# EAGLE design 4 port powered backplane (EAGLE 9.5.1)
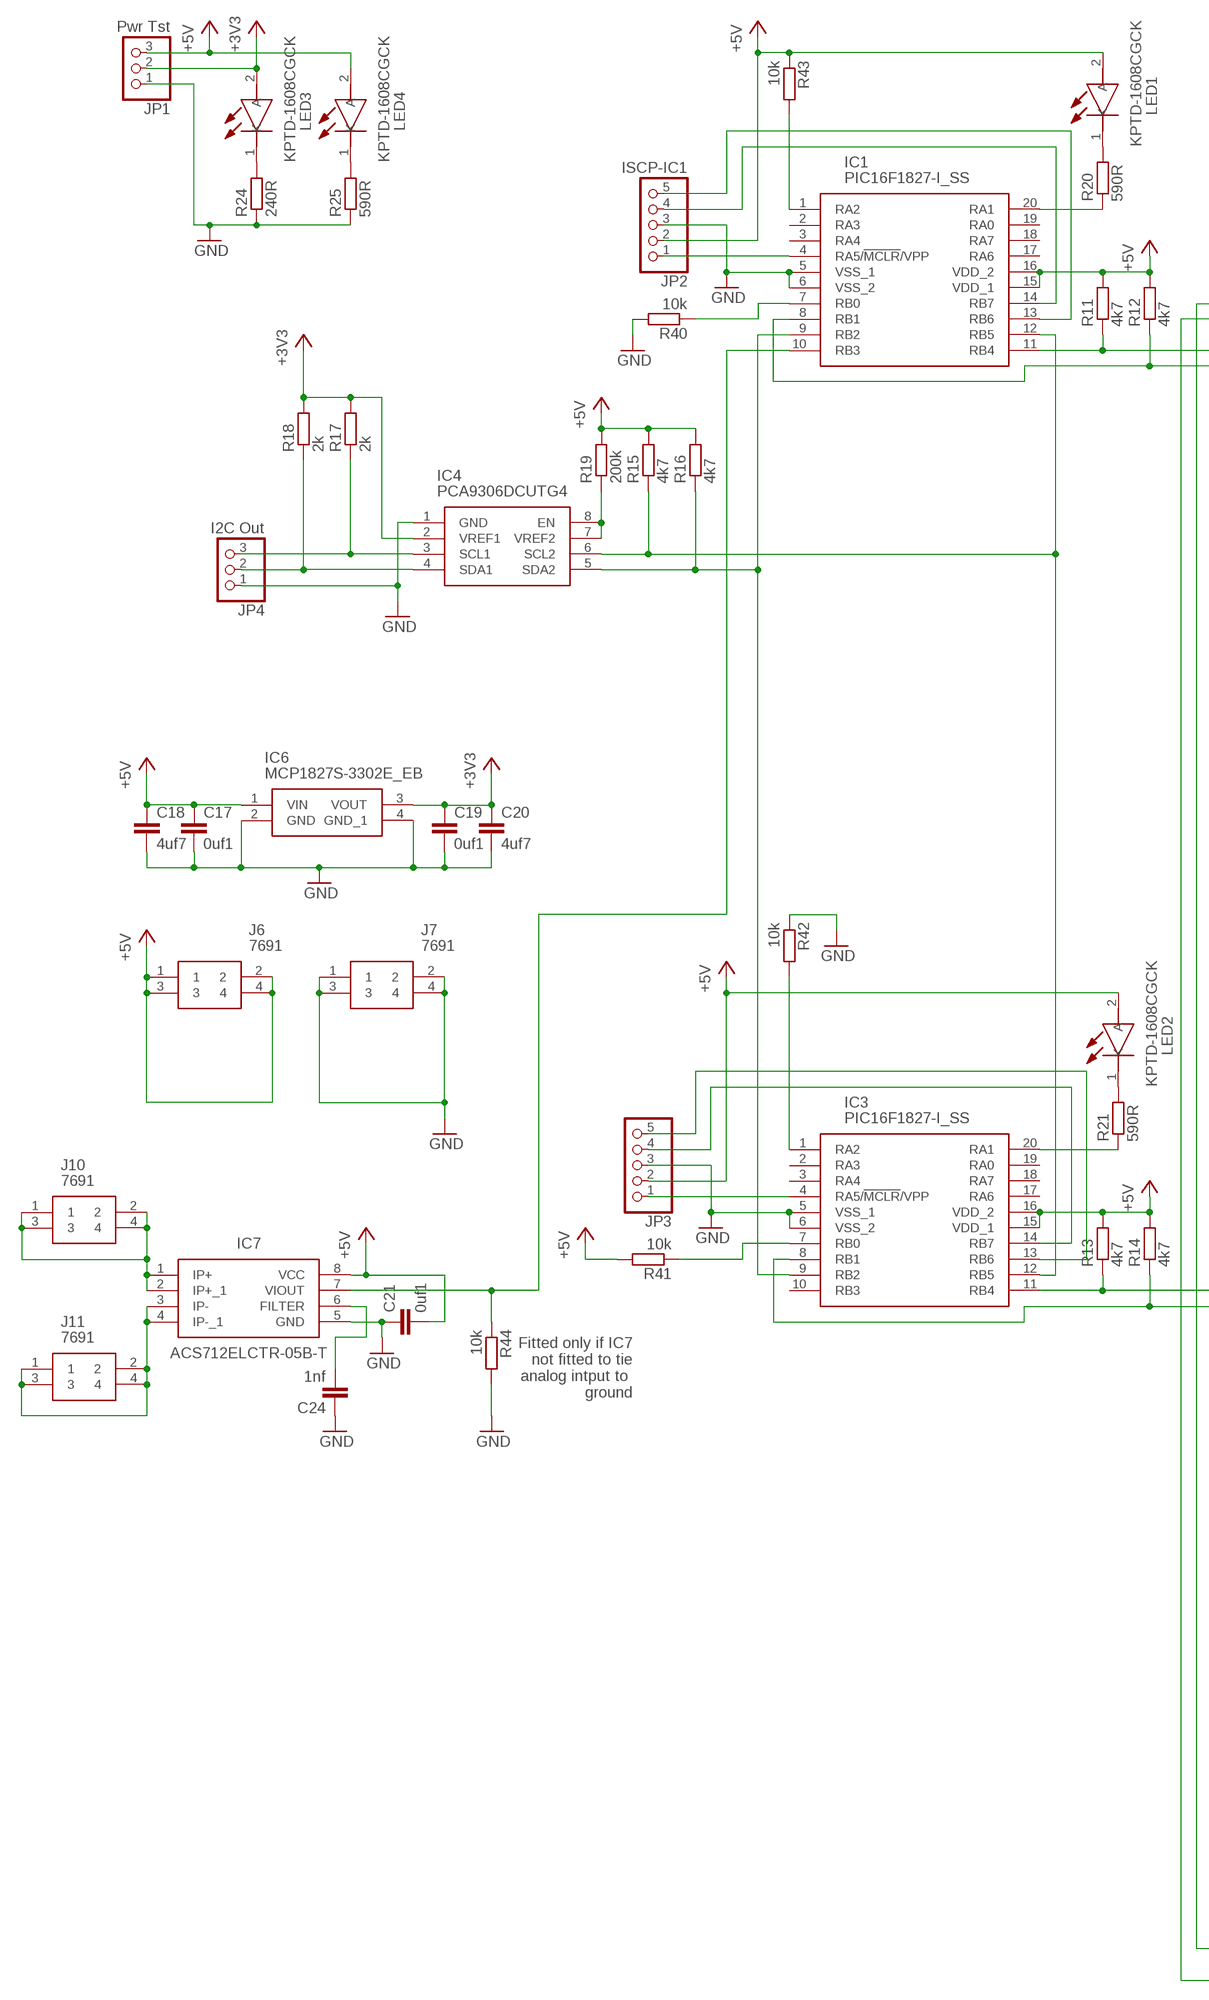
[diagram p0: schematic, sheet 1, part 1 of 2]
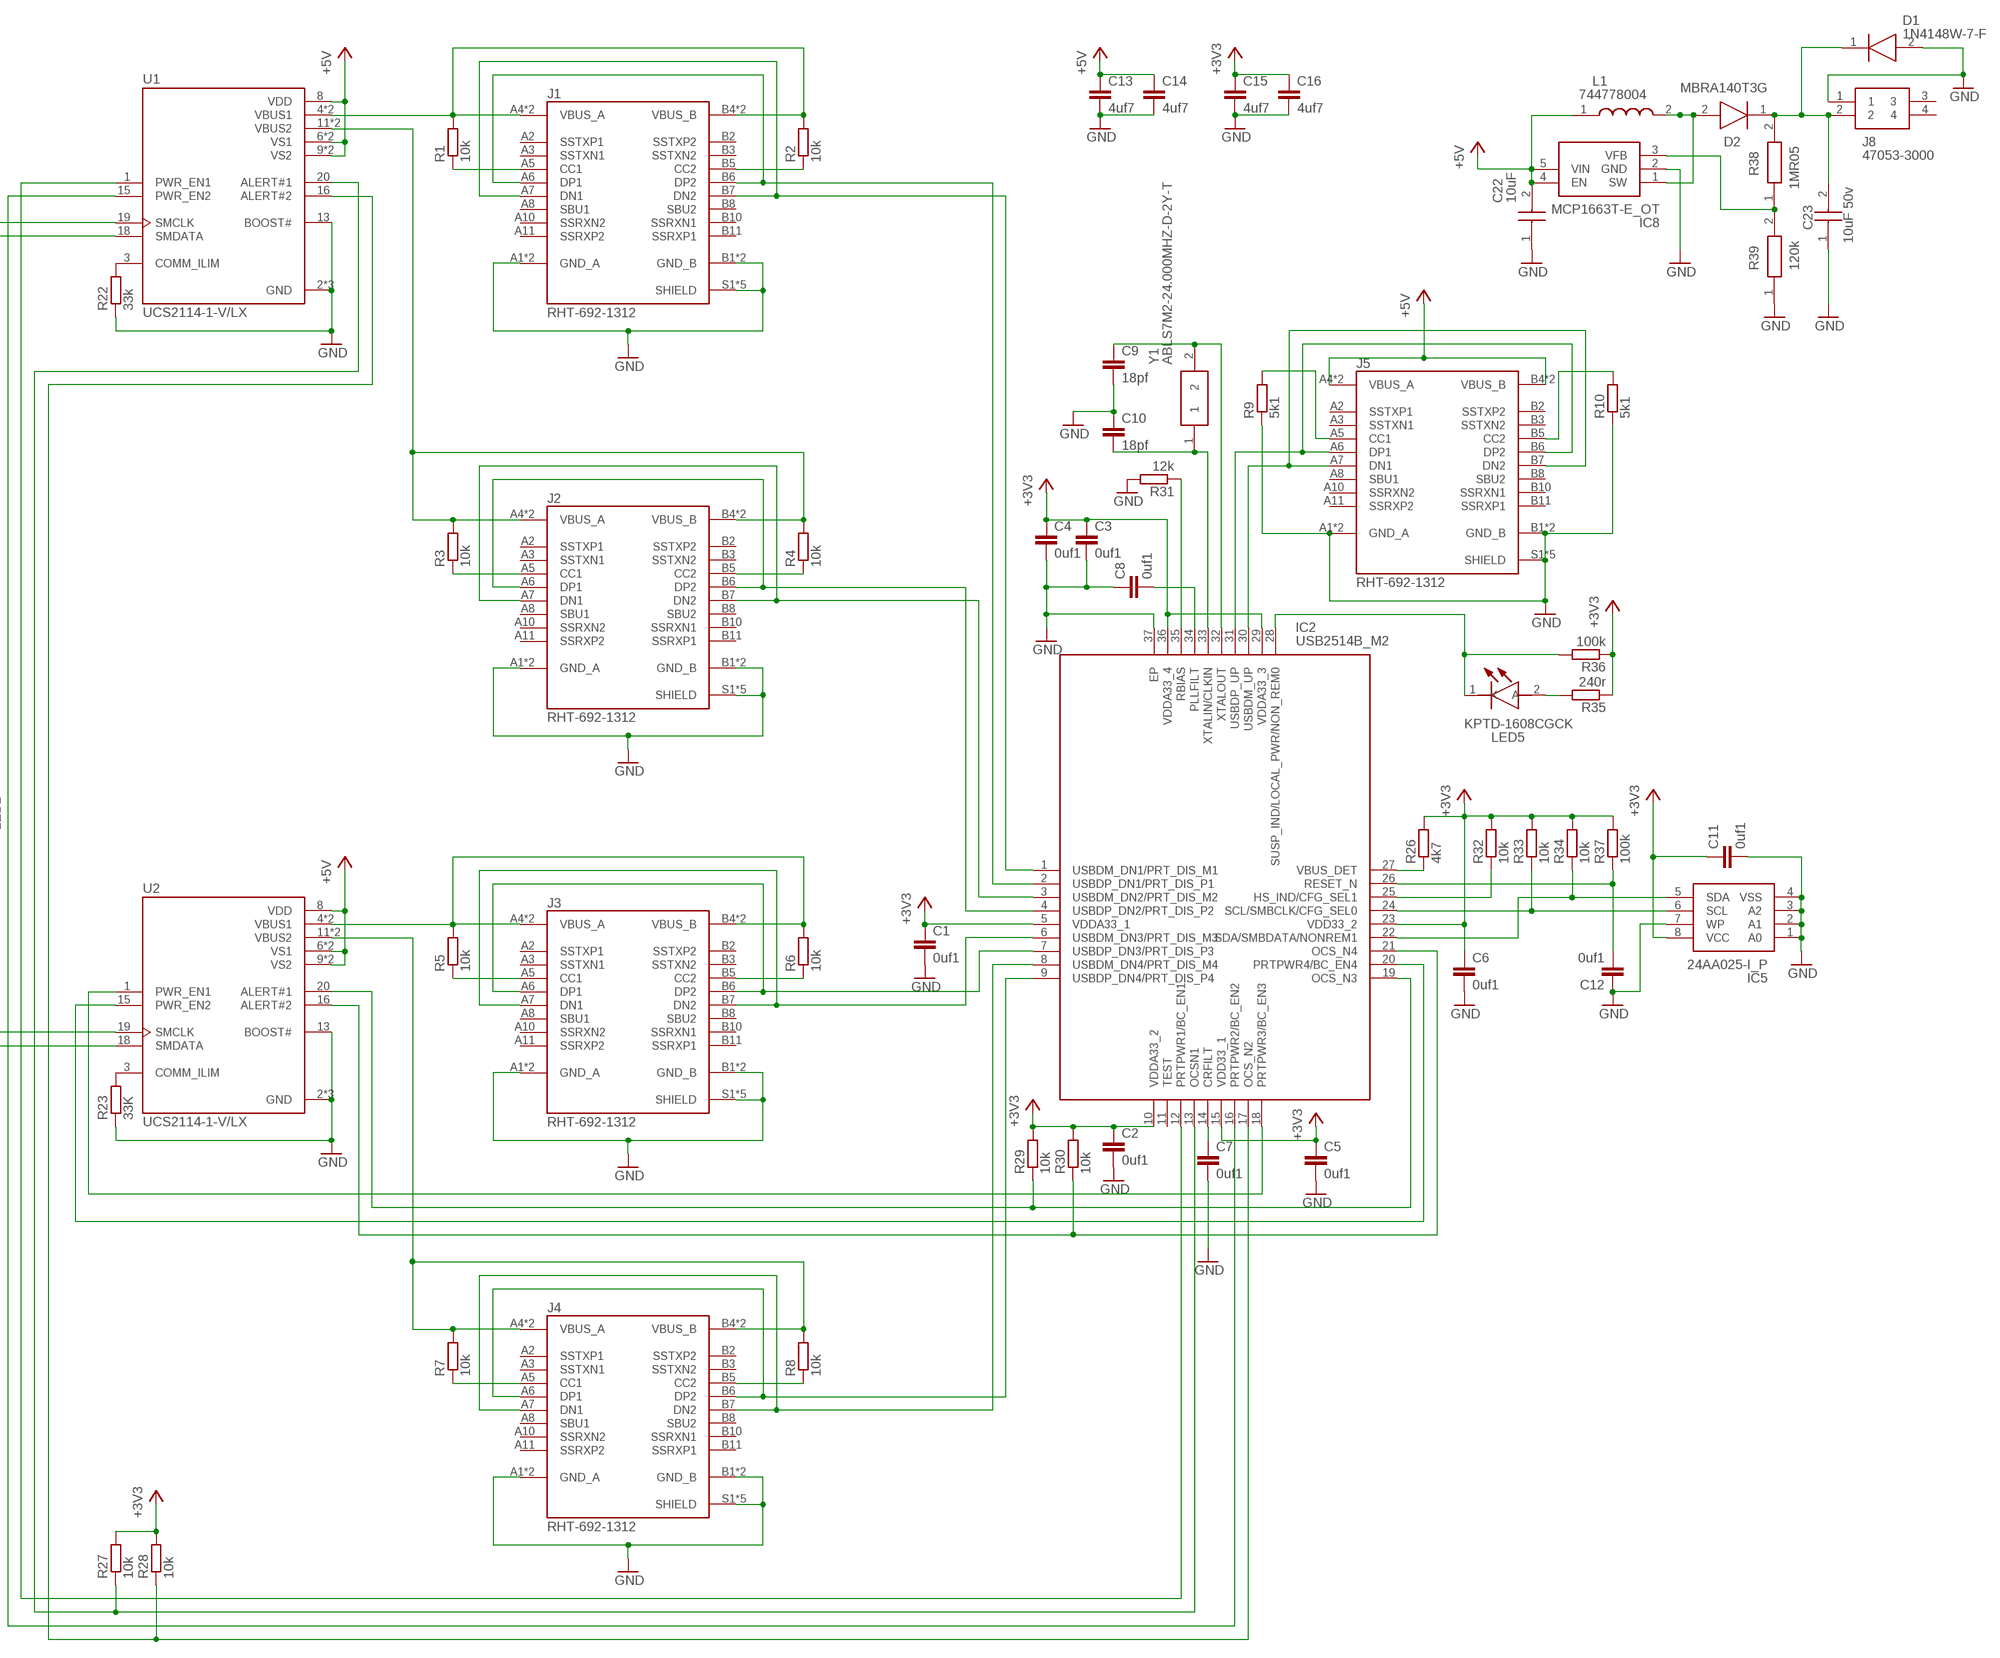
[diagram p1: schematic, sheet 1, part 2 of 2]

## Parts
C1  0uf1  C-EUC0603  [C0603]
C2  0uf1  C-EUC0603  [C0603]
C3  0uf1  C-EUC0603  [C0603]
C4  0uf1  C-EUC0603  [C0603]
C5  0uf1  C-EUC0603  [C0603]
C6  0uf1  C-EUC0603  [C0603]
C7  0uf1  C-EUC0603  [C0603]
C8  0uf1  C-EUC0603  [C0603]
C9  18pf  C-EUC0603  [C0603]
C10  18pf  C-EUC0603  [C0603]
C11  0uf1  C-EUC0603  [C0603]
C12  0uf1  C-EUC0603  [C0603]
C13  4uf7  C-EUC0603  [C0603]
C14  4uf7  C-EUC0603  [C0603]
C15  4uf7  C-EUC0603  [C0603]
C16  4uf7  C-EUC0603  [C0603]
C17  0uf1  C-EUC0603  [C0603]
C18  4uf7  C-EUC0603  [C0603]
C19  0uf1  C-EUC0603  [C0603]
C20  4uf7  C-EUC0603  [C0603]
C21  0uf1  C-EUC0603  [C0603]
C22  10uF  C2012X7R1A106K125AC  [CAPC2012X145N]
C23  10uF 50v  C3225X7R1H106M250AC  [CAPC3225X230N]
C24  1nf  C-EUC0603  [C0603]
D1  1N4148W-7-F  [SOD3716X115N]
D2  MBRA140T3G  [DIOM5226X220N]
IC1  PIC16F1827-I_SS  [SOP65P780X200-20N]
IC2  USB2514B_M2  [QFN50P600X600X100-37N]
IC3  PIC16F1827-I_SS  [SOP65P780X200-20N]
IC4  PCA9306DCUTG4  [SOP50P310X90-8N]
IC5  24AA025-I_P  [DIP781W56P254L950H533Q8N]
IC6  MCP1827S-3302E_EB  [TO254P1491X508-4N]
IC7  ACS712ELCTR-05B-T  [SOIC127P600X175-8N]
IC8  MCP1663T-E_OT  [SOT95P270X145-5N]
J1  RHT-692-1312  [RENHOTEC_RHT-692-1312]
J2  RHT-692-1312  [RENHOTEC_RHT-692-1312]
J3  RHT-692-1312  [RENHOTEC_RHT-692-1312]
J4  RHT-692-1312  [RENHOTEC_RHT-692-1312]
J5  RHT-692-1312  [RENHOTEC_RHT-692-1312]
J6  7691  [7691]
J7  7691  [7691]
J8  47053-3000  [470533000]
J10  7691  [7691]
J11  7691  [7691]
JP1  Pwr Tst  PINHD-1X3  [1X03]
JP2  ISCP-IC1  PINHD-1X5  [1X05]
JP3  PINHD-1X5  [1X05]
JP4  I2C Out  PINHD-1X3  [1X03]
L1  744778004  [744778004]
LED1  KPTD-1608CGCK  [LEDC1608X85N]
LED2  KPTD-1608CGCK  [LEDC1608X85N]
LED3  KPTD-1608CGCK  [LEDC1608X85N]
LED4  KPTD-1608CGCK  [LEDC1608X85N]
LED5  KPTD-1608CGCK  [LEDC1608X85N]
R1  10k  R-EU_R0603  [R0603]
R2  10k  R-EU_R0603  [R0603]
R3  10k  R-EU_R0603  [R0603]
R4  10k  R-EU_R0603  [R0603]
R5  10k  R-EU_R0603  [R0603]
R6  10k  R-EU_R0603  [R0603]
R7  10k  R-EU_R0603  [R0603]
R8  10k  R-EU_R0603  [R0603]
R9  5k1  R-EU_R0603  [R0603]
R10  5k1  R-EU_R0603  [R0603]
R11  4k7  R-EU_R0603  [R0603]
R12  4k7  R-EU_R0603  [R0603]
R13  4k7  R-EU_R0603  [R0603]
R14  4k7  R-EU_R0603  [R0603]
R15  4k7  R-EU_R0603  [R0603]
R16  4k7  R-EU_R0603  [R0603]
R17  2k  R-EU_R0603  [R0603]
R18  2k  R-EU_R0603  [R0603]
R19  200k  R-EU_R0603  [R0603]
R20  590R  R-EU_R0603  [R0603]
R21  590R  R-EU_R0603  [R0603]
R22  33k  R-EU_R0603  [R0603]
R23  33K  R-EU_R0603  [R0603]
R24  240R  R-EU_R0603  [R0603]
R25  590R  R-EU_R0603  [R0603]
R26  4k7  R-EU_R0603  [R0603]
R27  10k  R-EU_R0603  [R0603]
R28  10k  R-EU_R0603  [R0603]
R29  10k  R-EU_R0603  [R0603]
R30  10k  R-EU_R0603  [R0603]
R31  12k  R-EU_R0603  [R0603]
R32  10k  R-EU_R0603  [R0603]
R33  10k  R-EU_R0603  [R0603]
R34  10k  R-EU_R0603  [R0603]
R35  240r  R-EU_R0603  [R0603]
R36  100k  R-EU_R0603  [R0603]
R37  100k  R-EU_R0603  [R0603]
R38  1MR05  ERJ6ENF1054V  [RESC2012X70N]
R39  120k  ERJ6ENF1203V  [RESC2012X70N]
R40  10k  R-EU_R0603  [R0603]
R41  10k  R-EU_R0603  [R0603]
R42  10k  R-EU_R0603  [R0603]
R43  10k  R-EU_R0603  [R0603]
R44  10k  R-EU_R0603  [R0603]
U1  UCS2114-1-V/LX  [IC_UCS2114-1-V/LX]
U2  UCS2114-1-V/LX  [IC_UCS2114-1-V/LX]
Y1  ABLS7M2-24.000MHZ-D-2Y-T  [ABLS7M2]

## Nets
+3V3: C1.1 C2.1 C3.1 C4.1 C5.1 C6.1 C11.1 C15.1 C16.1 C19.1 C20.1 IC2.5(VDDA33_1) IC2.10(VDDA33_2) IC2.15(VDD33_1) IC2.23(VDD33_2) IC2.29(VDDA33_3) IC2.36(VDDA33_4) IC4.2(VREF1) IC5.8(VCC) IC6.3(VOUT) JP1.2 LED3.2(A) R17.2 R18.2 R26.2 R27.2 R28.2 R29.2 R30.2 R32.2 R33.2 R34.2 R35.1 R36.1 R37.2
+5V: C13.1 C14.1 C17.1 C18.1 C21.2 C22.2 IC1.15(VDD_1) IC1.16(VDD_2) IC3.15(VDD_1) IC3.16(VDD_2) IC6.1(VIN) IC7.8(VCC) IC8.4(EN) IC8.5(VIN) J5.A4(VBUS_A) J5.A9(VBUS_A) J5.B4(VBUS_B) J5.B9(VBUS_B) J6.1 J6.2 J6.3 J6.4 JP1.3 JP2.2 JP3.2 L1.1 LED1.2(A) LED2.2(A) LED4.2(A) R11.2 R12.2 R13.2 R14.2 R15.2 R16.2 R19.2 R41.2 R43.1 U1.6(VS1) U1.7(VS1) U1.8(VDD) U1.9(VS2) U1.10(VS2) U2.6(VS1) U2.7(VS1) U2.8(VDD) U2.9(VS2) U2.10(VS2)
DOWN1_N [USB]: IC2.1(USBDM_DN1/PRT_DIS_M1) J1.A7(DN1) J1.B7(DN2)
DOWN1_P [USB]: IC2.2(USBDP_DN1/PRT_DIS_P1) J1.A6(DP1) J1.B6(DP2)
DOWN2_N [USB]: IC2.3(USBDM_DN2/PRT_DIS_M2) J2.A7(DN1) J2.B7(DN2)
DOWN2_P [USB]: IC2.4(USBDP_DN2/PRT_DIS_P2) J2.A6(DP1) J2.B6(DP2)
DOWN3_N [USB]: IC2.6(USBDM_DN3/PRT_DIS_M3) J3.A7(DN1) J3.B7(DN2)
DOWN3_P [USB]: IC2.7(USBDP_DN3/PRT_DIS_P3) J3.A6(DP1) J3.B6(DP2)
DOWN4_N [USB]: IC2.8(USBDM_DN4/PRT_DIS_M4) J4.A7(DN1) J4.B7(DN2)
DOWN4_P [USB]: IC2.9(USBDP_DN4/PRT_DIS_P4) J4.A6(DP1) J4.B6(DP2)
GND: C1.2 C2.2 C3.2 C4.2 C5.2 C6.2 C7.2 C8.1 C9.2 C10.1 C11.2 C12.1 C13.2 C14.2 C15.2 C16.2 C17.2 C18.2 C19.2 C20.2 C21.1 C22.1 C23.1 C24.1 D1.2(A) IC1.5(VSS_1) IC1.6(VSS_2) IC2.37(EP) IC3.5(VSS_1) IC3.6(VSS_2) IC4.1(GND) IC5.1(A0) IC5.2(A1) IC5.3(A2) IC5.4(VSS) IC5.7(WP) IC6.2(GND) IC6.4(GND_1) IC7.5(GND) IC8.2(GND) J1.A1(GND_A) J1.A12(GND_A) J1.B1(GND_B) J1.B12(GND_B) J1.S1(SHIELD) J1.S2(SHIELD) J1.S3(SHIELD) J1.S4(SHIELD) J1.S5(SHIELD) J2.A1(GND_A) J2.A12(GND_A) J2.B1(GND_B) J2.B12(GND_B) J2.S1(SHIELD) J2.S2(SHIELD) J2.S3(SHIELD) J2.S4(SHIELD) J2.S5(SHIELD) J3.A1(GND_A) J3.A12(GND_A) J3.B1(GND_B) J3.B12(GND_B) J3.S1(SHIELD) J3.S2(SHIELD) J3.S3(SHIELD) J3.S4(SHIELD) J3.S5(SHIELD) J4.A1(GND_A) J4.A12(GND_A) J4.B1(GND_B) J4.B12(GND_B) J4.S1(SHIELD) J4.S2(SHIELD) J4.S3(SHIELD) J4.S4(SHIELD) J4.S5(SHIELD) J5.A1(GND_A) J5.A12(GND_A) J5.B1(GND_B) J5.B12(GND_B) J5.S1(SHIELD) J5.S2(SHIELD) J5.S3(SHIELD) J5.S4(SHIELD) J5.S5(SHIELD) J7.1 J7.2 J7.3 J7.4 J8.1 JP1.1 JP2.3 JP3.3 JP4.1 R9.1 R10.1 R22.1 R23.1 R24.1 R25.1 R31.2 R39.1 R40.2 R42.1 R44.2 U1.2(GND) U1.13(BOOST#) U1.14(GND) U1.17(GND) U2.2(GND) U2.13(BOOST#) U2.14(GND) U2.17(GND)
N$1: IC1.10(RB3) IC7.7(VIOUT) R44.1
N$2: D2.2(A) IC8.1(SW) L1.2
N$3: C23.2 D1.1(K) D2.1(K) J8.2 R38.2
N$4: IC8.3(VFB) R38.1 R39.2
N$5: C24.2 IC7.6(FILTER)
N$6: IC1.7(RB0) R40.1
N$7: IC3.7(RB0) R41.1
N$8: IC3.1(RA2) R42.2
N$10: IC1.1(RA2) R43.2
N$11: J5.A5(CC1) R9.2
N$12: J5.B5(CC2) R10.2
N$13: IC1.11(RB4) R11.1 U1.19(SMCLK)
N$14: IC2.27(VBUS_DET) R26.1
N$15: J2.A5(CC1) R3.1
N$16: J2.B5(CC2) R4.1
N$17: J1.A5(CC1) R1.1
N$18: J1.B5(CC2) R2.1
N$19: J4.A5(CC1) R7.1
N$20: J4.B5(CC2) R8.1
N$21: J1.A4(VBUS_A) J1.A9(VBUS_A) J1.B4(VBUS_B) J1.B9(VBUS_B) R1.2 R2.2 U1.4(VBUS1) U1.5(VBUS1)
N$22: J2.A4(VBUS_A) J2.A9(VBUS_A) J2.B4(VBUS_B) J2.B9(VBUS_B) R3.2 R4.2 U1.11(VBUS2) U1.12(VBUS2)
N$23: J3.A5(CC1) R5.1
N$24: J3.B5(CC2) R6.1
N$27: IC2.13(OCSN1) R27.1 U1.20(ALERT#1)
N$28: IC2.12(PRTPWR1/BC_EN1) U1.1(PWR_EN1)
N$29: IC2.16(PRTPWR2/BC_EN2) U1.15(PWR_EN2)
N$30: IC2.17(OCS_N2) R28.1 U1.16(ALERT#2)
N$31: IC2.18(PRTPWR3/BC_EN3) U2.1(PWR_EN1)
N$32: IC2.20(PRTPWR4/BC_EN4) U2.15(PWR_EN2)
N$33: IC2.19(OCS_N3) R29.1 U2.20(ALERT#1)
N$34: IC2.21(OCS_N4) R30.1 U2.16(ALERT#2)
N$35: IC3.11(RB4) R13.1 U2.19(SMCLK)
N$36: IC3.8(RB1) R14.1 U2.18(SMDATA)
N$37: IC1.9(RB2) IC3.9(RB2) IC4.5(SDA2) R16.1
N$38: IC1.12(RB5) IC3.12(RB5) IC4.6(SCL2) R15.1
N$39: C7.1 IC2.14(CRFILT)
N$40: IC1.8(RB1) R12.1 U1.18(SMDATA)
N$41: IC1.4(RA5/!MCLR!/VPP) JP2.1
N$42: IC4.7(VREF2) IC4.8(EN) R19.1
N$43: IC4.3(SCL1) JP4.3 R17.1
N$44: IC4.4(SDA1) JP4.2 R18.1
N$45: IC3.4(RA5/!MCLR!/VPP) JP3.1
N$46: IC1.14(RB7) JP2.4
N$47: IC1.13(RB6) JP2.5
N$49: IC3.14(RB7) JP3.4
N$50: IC3.13(RB6) JP3.5
N$51: IC1.20(RA1) R20.1
N$52: IC3.20(RA1) R21.1
N$53: LED1.1(K) R20.2
N$54: LED2.1(K) R21.2
N$55: R22.2 U1.3(COMM_ILIM)
N$56: R23.2 U2.3(COMM_ILIM)
N$57: LED3.1(K) R24.2
N$58: LED4.1(K) R25.2
N$59: C8.2 IC2.34(PLLFILT)
N$61: C10.2 IC2.33(XTALIN/CLKIN) Y1.1
N$62: C9.1 IC2.32(XTALOUT) Y1.2
N$63: IC2.24(SCL/SMBCLK/CFG_SEL0) IC5.6(SCL) R33.1
N$64: IC2.22(SDA/SMBDATA/NONREM1) IC5.5(SDA) R34.1
N$65: IC2.35(RBIAS) R31.1
N$66: IC2.25(HS_IND/CFG_SEL1) R32.1
N$67: LED5.2(A) R35.2
N$68: IC2.28(SUSP_IND/LOCAL_PWR/NON_REM0) LED5.1(K) R36.2
N$69: C12.2 IC2.26(RESET_N) R37.1
N$71: IC7.3(IP-) IC7.4(IP-_1) J11.1 J11.2 J11.3 J11.4
N$72: IC7.1(IP+) IC7.2(IP+_1) J10.1 J10.2 J10.3 J10.4
PWR3: J3.A4(VBUS_A) J3.A9(VBUS_A) J3.B4(VBUS_B) J3.B9(VBUS_B) R5.2 R6.2 U2.4(VBUS1) U2.5(VBUS1)
PWR4: J4.A4(VBUS_A) J4.A9(VBUS_A) J4.B4(VBUS_B) J4.B9(VBUS_B) R7.2 R8.2 U2.11(VBUS2) U2.12(VBUS2)
UP_N [USB]: IC2.30(USBDM_UP) J5.A7(DN1) J5.B7(DN2)
UP_P [USB]: IC2.31(USBDP_UP) J5.A6(DP1) J5.B6(DP2)
Unconnected: IC1.2(RA3) IC1.3(RA4) IC1.17(RA6) IC1.18(RA7) IC1.19(RA0) IC2.11(TEST) IC3.2(RA3) IC3.3(RA4) IC3.10(RB3) IC3.17(RA6) IC3.18(RA7) IC3.19(RA0) J1.A2(SSTXP1) J1.A3(SSTXN1) J1.A8(SBU1) J1.A10(SSRXN2) J1.A11(SSRXP2) J1.B2(SSTXP2) J1.B3(SSTXN2) J1.B8(SBU2) J1.B10(SSRXN1) J1.B11(SSRXP1) J2.A2(SSTXP1) J2.A3(SSTXN1) J2.A8(SBU1) J2.A10(SSRXN2) J2.A11(SSRXP2) J2.B2(SSTXP2) J2.B3(SSTXN2) J2.B8(SBU2) J2.B10(SSRXN1) J2.B11(SSRXP1) J3.A2(SSTXP1) J3.A3(SSTXN1) J3.A8(SBU1) J3.A10(SSRXN2) J3.A11(SSRXP2) J3.B2(SSTXP2) J3.B3(SSTXN2) J3.B8(SBU2) J3.B10(SSRXN1) J3.B11(SSRXP1) J4.A2(SSTXP1) J4.A3(SSTXN1) J4.A8(SBU1) J4.A10(SSRXN2) J4.A11(SSRXP2) J4.B2(SSTXP2) J4.B3(SSTXN2) J4.B8(SBU2) J4.B10(SSRXN1) J4.B11(SSRXP1) J5.A2(SSTXP1) J5.A3(SSTXN1) J5.A8(SBU1) J5.A10(SSRXN2) J5.A11(SSRXP2) J5.B2(SSTXP2) J5.B3(SSTXN2) J5.B8(SBU2) J5.B10(SSRXN1) J5.B11(SSRXP1) J8.3 J8.4

## Notes on the sheet
- Fitted only if IC7
  not fitted to tie
  analog intput to 
  ground

## Library data of the parts
C1-C21 C24 = resistor:C-EU: CAPACITOR, European symbol
C22 = SamacSys_Parts:C2012X7R1A106K125AC: 0805 X7R ceramic capacitor 10uF 10V TDK 0805 C 10uF Ceramic Multilayer Capacitor, 10 V dc, +125C, X7R Dielectric, +/-10% SMD Source: Datasheet <https://product.tdk.com/info/en/catalog/datasheets/mlcc_commercial_midvoltage_en.pdf>; DESCRIPTION: 0805 X7R ceramic capacitor 10uF 10V TDK 0805 C 10uF Ceramic Multilayer Capacitor, 10 V dc, +125C, X7R Dielectric, +/-10% SMD; HEIGHT: 1.45mm; MANUFACTURER_NAME: TDK; MANUFACTURER_PART_NUMBER: C2012X7R1A106K125AC; MOUSER_PART_NUMBER: 810-C2012X7R1A106K; MOUSER_PRICE-STOCK: https://www.mouser.com/Search/Refine.aspx?Keyword=810-C2012X7R1A106K; RS_PART_NUMBER: 7883017P; RS_PRICE-STOCK: http://uk.rs-online.com/web/p/products/7883017P
C23 = SamacSys_Parts:C3225X7R1H106M250AC: TDK 1210 C 10uF Ceramic Multilayer Capacitor, 50 V dc, +125C, X7R Dielectric, +/-20% Source: Datasheet <https://product.tdk.com/info/en/catalog/datasheets/mlcc_commercial_midvoltage_en.pdf>; DESCRIPTION: TDK 1210 C 10uF Ceramic Multilayer Capacitor, 50 V dc, +125C, X7R Dielectric, +/-20%; HEIGHT: 2.3mm; MANUFACTURER_NAME: TDK; MANUFACTURER_PART_NUMBER: C3225X7R1H106M250AC; MOUSER_PART_NUMBER: 810-C3225X7R1H106MAC; MOUSER_PRICE-STOCK: https://www.mouser.com/Search/Refine.aspx?Keyword=810-C3225X7R1H106MAC; RS_PART_NUMBER: 9163024P; RS_PRICE-STOCK: http://uk.rs-online.com/web/p/products/9163024P
D1 = SamacSys_Parts:1N4148W-7-F: Diode Switching 150mA 100V 400mW SOD123 Diodes Inc 1N4148W-7-F Switching Diode 100V, 2-Pin SOD-123 Source: Datasheet <https://componentsearchengine.com/Datasheets/2/1N4148W-7-F.pdf>; ALLIED_NUMBER: 71028125; ALLIED_PRICE-STOCK: https://www.alliedelec.com/diodes-inc-1n4148w-7-f/71028125/; DESCRIPTION: Diode Switching 150mA 100V 400mW SOD123 Diodes Inc 1N4148W-7-F Switching Diode 100V, 2-Pin SOD-123; HEIGHT: 1.15mm; MANUFACTURER_NAME: Diodes Inc.; MANUFACTURER_PART_NUMBER: 1N4148W-7-F; MOUSER_PART_NUMBER: 621-1N4148W-F; MOUSER_PRICE-STOCK: https://www.mouser.com/Search/Refine.aspx?Keyword=621-1N4148W-F; RS_PART_NUMBER: 7384728P; RS_PRICE-STOCK: http://uk.rs-online.com/web/p/products/7384728P
D2 = SamacSys_Parts:MBRA140T3G: Schottky Rectifier 1A 40V SMA ON Semiconductor MBRA140T3G Schottky Diode, 1A, 40V, 2-Pin SMA Source: Datasheet <http://www.onsemi.com/pub/Collateral/MBRA140T3-D.PDF>; ALLIED_NUMBER: 70339901; ALLIED_PRICE-STOCK: http://www.alliedelec.com/on-semiconductor-mbra140t3g/70339901/; DESCRIPTION: Schottky Rectifier 1A 40V SMA ON Semiconductor MBRA140T3G Schottky Diode, 1A, 40V, 2-Pin SMA; HEIGHT: 2.2mm; MANUFACTURER_NAME: ON Semiconductor; MANUFACTURER_PART_NUMBER: MBRA140T3G; MOUSER_PART_NUMBER: 863-MBRA140T3G; MOUSER_PRICE-STOCK: https://www.mouser.com/Search/Refine.aspx?Keyword=863-MBRA140T3G; RS_PART_NUMBER: 6255650P; RS_PRICE-STOCK: http://uk.rs-online.com/web/p/products/6255650P
IC1 IC3 = SamacSys_Parts:PIC16F1827-I_SS: MCU 7 KB Flash with 32 MHz Osc, 16 I/0 Source: Datasheet <http://docs-emea.rs-online.com/webdocs/0dc9/0900766b80dc9c10.pdf>; ALLIED_NUMBER: 70047493; ALLIED_PRICE-STOCK: http://www.alliedelec.com/microchip-technology-inc-pic16f1827-i-ss/70047493/; DESCRIPTION: MCU 7 KB Flash with 32 MHz Osc, 16 I/0; HEIGHT: 2mm; MANUFACTURER_NAME: Microchip; MANUFACTURER_PART_NUMBER: PIC16F1827-I/SS; MOUSER_PART_NUMBER: 579-PIC16F1827-I/SS; MOUSER_PRICE-STOCK: https://www.mouser.com/Search/Refine.aspx?Keyword=579-PIC16F1827-I%2FSS; RS_PART_NUMBER: 6988962P; RS_PRICE-STOCK: http://uk.rs-online.com/web/p/products/6988962P
IC2 = SamacSys_Parts:USB2514B_M2: MICROCHIP - USB2514B/M2 - USB HUB CONTROLLER, USB2.0, SQFN-36 Source: Datasheet <https://componentsearchengine.com/Datasheets/1/USB2514B_M2.pdf>; DESCRIPTION: MICROCHIP - USB2514B/M2 - USB HUB CONTROLLER, USB2.0, SQFN-36; HEIGHT: 1mm; MANUFACTURER_NAME: Microchip; MANUFACTURER_PART_NUMBER: USB2514B/M2; MOUSER_PART_NUMBER: 579-USB2514B/M2; MOUSER_PRICE-STOCK: https://www.mouser.com/Search/Refine.aspx?Keyword=579-USB2514B%2FM2
IC4 = SamacSys_Parts:PCA9306DCUTG4: 2-bit bidirectional I2C bus and SMBus voltage-level shifter Source: Datasheet <http://www.ti.com/general/docs/lit/getliterature.tsp?genericPartNumber=pca9306&fileType=pdf>; DESCRIPTION: 2-bit bidirectional I2C bus and SMBus voltage-level shifter; HEIGHT: 0.9mm; MANUFACTURER_NAME: Texas Instruments; MANUFACTURER_PART_NUMBER: PCA9306DCUTG4; MOUSER_PART_NUMBER: 595-PCA9306DCUTG4; MOUSER_PRICE-STOCK: https://www.mouser.com/Search/Refine.aspx?Keyword=595-PCA9306DCUTG4
IC5 = SamacSys_Parts-old:24AA025-I_P: MICROCHIP - 24AA025-I/P - EEPROM, 2KBIT, I2C, 400KHZ, DIP-8 Source: Datasheet <http://ww1.microchip.com/downloads/en/DeviceDoc/21210N.pdf>; ARROW_PART_NUMBER: 24AA025-I/P; ARROW_PRICE/STOCK: https://www.arrow.com/en/products/24aa025-ip/microchip-technology; DESCRIPTION: MICROCHIP - 24AA025-I/P - EEPROM, 2KBIT, I2C, 400KHZ, DIP-8; HEIGHT: 5.334mm; MANUFACTURER_NAME: Microchip; MANUFACTURER_PART_NUMBER: 24AA025-I/P
IC6 = SamacSys_Parts-old:MCP1827S-3302E_EB: LDO Regulator Positive 3.3V 1.5A Source: Datasheet <http://ww1.microchip.com/downloads/en/DeviceDoc/22001d.pdf>; ALLIED_NUMBER: 70414672; ALLIED_PRICE/STOCK: http://www.alliedelec.com/microchip-technology-inc-mcp1827s-3302e-eb/70414672/; DESCRIPTION: LDO Regulator Positive 3.3V 1.5A; HEIGHT: 5.08mm; MANUFACTURER_NAME: Microchip; MANUFACTURER_PART_NUMBER: MCP1827S-3302E/EB; RS_PART_NUMBER: 1458978; RS_PRICE/STOCK: http://uk.rs-online.com/web/p/products/1458978
IC7 = SamacSys_Parts-old:ACS712ELCTR-05B-T: Current Sensor, Bi 5A SOIC8 Allegro Microsystems ACS712ELCTR-05B-T Hall Effect Sensor 8-Pin SOIC, 4.5 5.5 V <https://componentsearchengine.com/Images/3/ACS712ELCTR-05B-T.jpg> Source: Datasheet <http://docs-europe.electrocomponents.com/webdocs/0d88/0900766b80d885f5.pdf>; ALLIED_NUMBER: R1076681; DESCRIPTION: Current Sensor, Bi 5A SOIC8 Allegro Microsystems ACS712ELCTR-05B-T Hall Effect Sensor 8-Pin SOIC, 4.5 5.5 V; HEIGHT: 1.75mm; MANUFACTURER_NAME: Allegro Microsystems; MANUFACTURER_PART_NUMBER: ACS712ELCTR-05B-T; RS_PART_NUMBER: 6807131; SUPPLIER_NAME: RS
IC8 = SamacSys_Parts:MCP1663T-E_OT: MICROCHIP - MCP1663T-E/OT - DC/DC CONV, BOOST, 500KHZ, SOT-23-5 Source: Datasheet <https://mouser.componentsearchengine.com/Datasheets/1/MCP1663T-E_OT.pdf>; ALLIED_NUMBER: 70578724; ALLIED_PRICE-STOCK: https://www.alliedelec.com/microchiptechnologyinc-mcp1663t-e-ot/70578724/; DESCRIPTION: MICROCHIP - MCP1663T-E/OT - DC/DC CONV, BOOST, 500KHZ, SOT-23-5; HEIGHT: 1.45mm; MANUFACTURER_NAME: Microchip; MANUFACTURER_PART_NUMBER: MCP1663T-E/OT; MOUSER_PART_NUMBER: 579-MCP1663T-E/OT; MOUSER_PRICE-STOCK: https://www.mouser.com/Search/Refine.aspx?Keyword=579-MCP1663T-E%2FOT
J1-J5 = RHT-692-1312:RHT-692-1312: USB C M-Type; AVAILABILITY: Unavailable; DESCRIPTION: USB C M-Type; MF: Renhotec; MP: RHT-692-1312; PACKAGE: Package Analog Devices; PRICE: None
J6 J7 J10 J11 = SamacSys_Parts-old:7691: Terminals VERT SCREW TERM MATTE TINNED Source: Datasheet <https://www.mouser.com/ds/2/215/691-741193.pdf>; DESCRIPTION: Terminals VERT SCREW TERM MATTE TINNED; HEIGHT: 6mm; MANUFACTURER_NAME: Keystone Electronics; MANUFACTURER_PART_NUMBER: 7691; RS_PART_NUMBER: 4096566; RS_PRICE/STOCK: http://uk.rs-online.com/web/p/products/4096566
J8 = SamacSys_Parts:47053-3000: Headers & Wire Housings 4 PIN HEADER WITH FR R WITH FRICTION LOCK Source: Datasheet <https://www.mouser.com/datasheet/2/276/0470533000_PCB_HEADERS-146177.pdf>; ALLIED_NUMBER: 71469769; ALLIED_PRICE-STOCK: https://www.alliedelec.com/molexincorporated-47053-3000/71469769/; DESCRIPTION: Headers & Wire Housings 4 PIN HEADER WITH FR R WITH FRICTION LOCK; HEIGHT: 9.84mm; MANUFACTURER_NAME: Molex; MANUFACTURER_PART_NUMBER: 47053-3000; MOUSER_PART_NUMBER: 538-47053-3000; MOUSER_PRICE-STOCK: https://www.mouser.com/Search/Refine.aspx?Keyword=538-47053-3000
JP1 JP4 = pinhead:PINHD-1X3: PIN HEADER
JP2 JP3 = pinhead:PINHD-1X5: PIN HEADER
L1 = SamacSys_Parts:744778004: Wurth WE-PD Series Shielded Wire-wound SMD Inductor with a Ferrite Core, 4.7 uH +/-20% 4.2A Idc Source: Datasheet <https://www.mouser.com/datasheet/2/445/744778004-1722682.pdf>; DESCRIPTION: Wurth WE-PD Series Shielded Wire-wound SMD Inductor with a Ferrite Core, 4.7 uH +/-20% 4.2A Idc; HEIGHT: 3.4mm; MANUFACTURER_NAME: Wurth Elektronik; MANUFACTURER_PART_NUMBER: 744778004; MOUSER_PART_NUMBER: 710-744778004; MOUSER_PRICE-STOCK: https://www.mouser.com/Search/Refine.aspx?Keyword=710-744778004; RS_PART_NUMBER: 7444927P; RS_PRICE-STOCK: http://uk.rs-online.com/web/p/products/7444927P
LED1-LED5 = SamacSys_Parts:KPTD-1608CGCK: Kingbright 570 nm Green LED, 1608 (0603) SMD package Source: Datasheet <https://componentsearchengine.com/Datasheets/2/KPTD-1608CGCK.pdf>; DESCRIPTION: Kingbright 570 nm Green LED, 1608 (0603) SMD package; HEIGHT: 0.85mm; MANUFACTURER_NAME: Kingbright; MANUFACTURER_PART_NUMBER: KPTD-1608CGCK; MOUSER_PART_NUMBER: N/A; MOUSER_PRICE-STOCK: https://www.mouser.com/Search/Refine.aspx?Keyword=N%2FA; RS_PART_NUMBER: 8609056P; RS_PRICE-STOCK: http://uk.rs-online.com/web/p/products/8609056P
R1-R37 R40-R44 = resistor:R-EU_: RESISTOR, European symbol
R38 = SamacSys_Parts:ERJ6ENF1054V: Panasonic E96 Series Precision Thick Film Surface Mount Fixed Resistor 0805 Case 1.05M +/-1% 0.125W +/-100ppm/C Source: Datasheet <http://docs-europe.electrocomponents.com/webdocs/13ba/0900766b813ba21b.pdf>; DESCRIPTION: Panasonic E96 Series Precision Thick Film Surface Mount Fixed Resistor 0805 Case 1.05M +/-1% 0.125W +/-100ppm/C; HEIGHT: 0.7mm; MANUFACTURER_NAME: Panasonic; MANUFACTURER_PART_NUMBER: ERJ6ENF1054V; RS_PART_NUMBER: 1140735; RS_PRICE-STOCK: http://uk.rs-online.com/web/p/products/1140735
R39 = SamacSys_Parts:ERJ6ENF1203V: Panasonic ERJ6EN Series Thick Film Surface Mount Fixed Resistor 0805 Case 120k +/-1% 0.125W +/-100ppm/C Source: Datasheet <http://docs-europe.electrocomponents.com/webdocs/13ba/0900766b813ba21b.pdf>; ALLIED_NUMBER: 70269600; ALLIED_PRICE-STOCK: https://www.alliedelec.com/panasonic-erj-6enf1203v/70269600/; DESCRIPTION: Panasonic ERJ6EN Series Thick Film Surface Mount Fixed Resistor 0805 Case 120k +/-1% 0.125W +/-100ppm/C; HEIGHT: 0.7mm; MANUFACTURER_NAME: Panasonic; MANUFACTURER_PART_NUMBER: ERJ6ENF1203V; RS_PART_NUMBER: 7326075; RS_PRICE-STOCK: http://uk.rs-online.com/web/p/products/7326075
U1 U2 = UCS2114-1-V_LX:UCS2114-1-V/LX: DUAL USB PORT POWER SWITCH; AVAILABILITY: Unavailable; DESCRIPTION: Power Switch/Driver 1:1 3A 20-VQFN _3x3_; MF: Microchip Technology; MP: UCS2114-1-V/LX; PACKAGE: VFQFN-20 Microchip Technology; PRICE: None
Y1 = SamacSys_Parts:ABLS7M2-24.000MHZ-D-2Y-T: ABRACON - ABLS7M2-24.000MHZ-D-2Y-T - CRYSTAL, 24MHZ, 18PF, HC-49US Source: Datasheet <http://abracon.com/Resonators/ABLS7M2.pdf>; DESCRIPTION: ABRACON - ABLS7M2-24.000MHZ-D-2Y-T - CRYSTAL, 24MHZ, 18PF, HC-49US; HEIGHT: mm; MANUFACTURER_NAME: ABRACON; MANUFACTURER_PART_NUMBER: ABLS7M2-24.000MHZ-D-2Y-T; MOUSER_PART_NUMBER: 815-ABLS7M2-24D2YT; MOUSER_PRICE-STOCK: https://www.mouser.com/Search/Refine.aspx?Keyword=815-ABLS7M2-24D2YT

## Net classes
1 USB: width 0.203 mm, clearance 0.127 mm

## Board
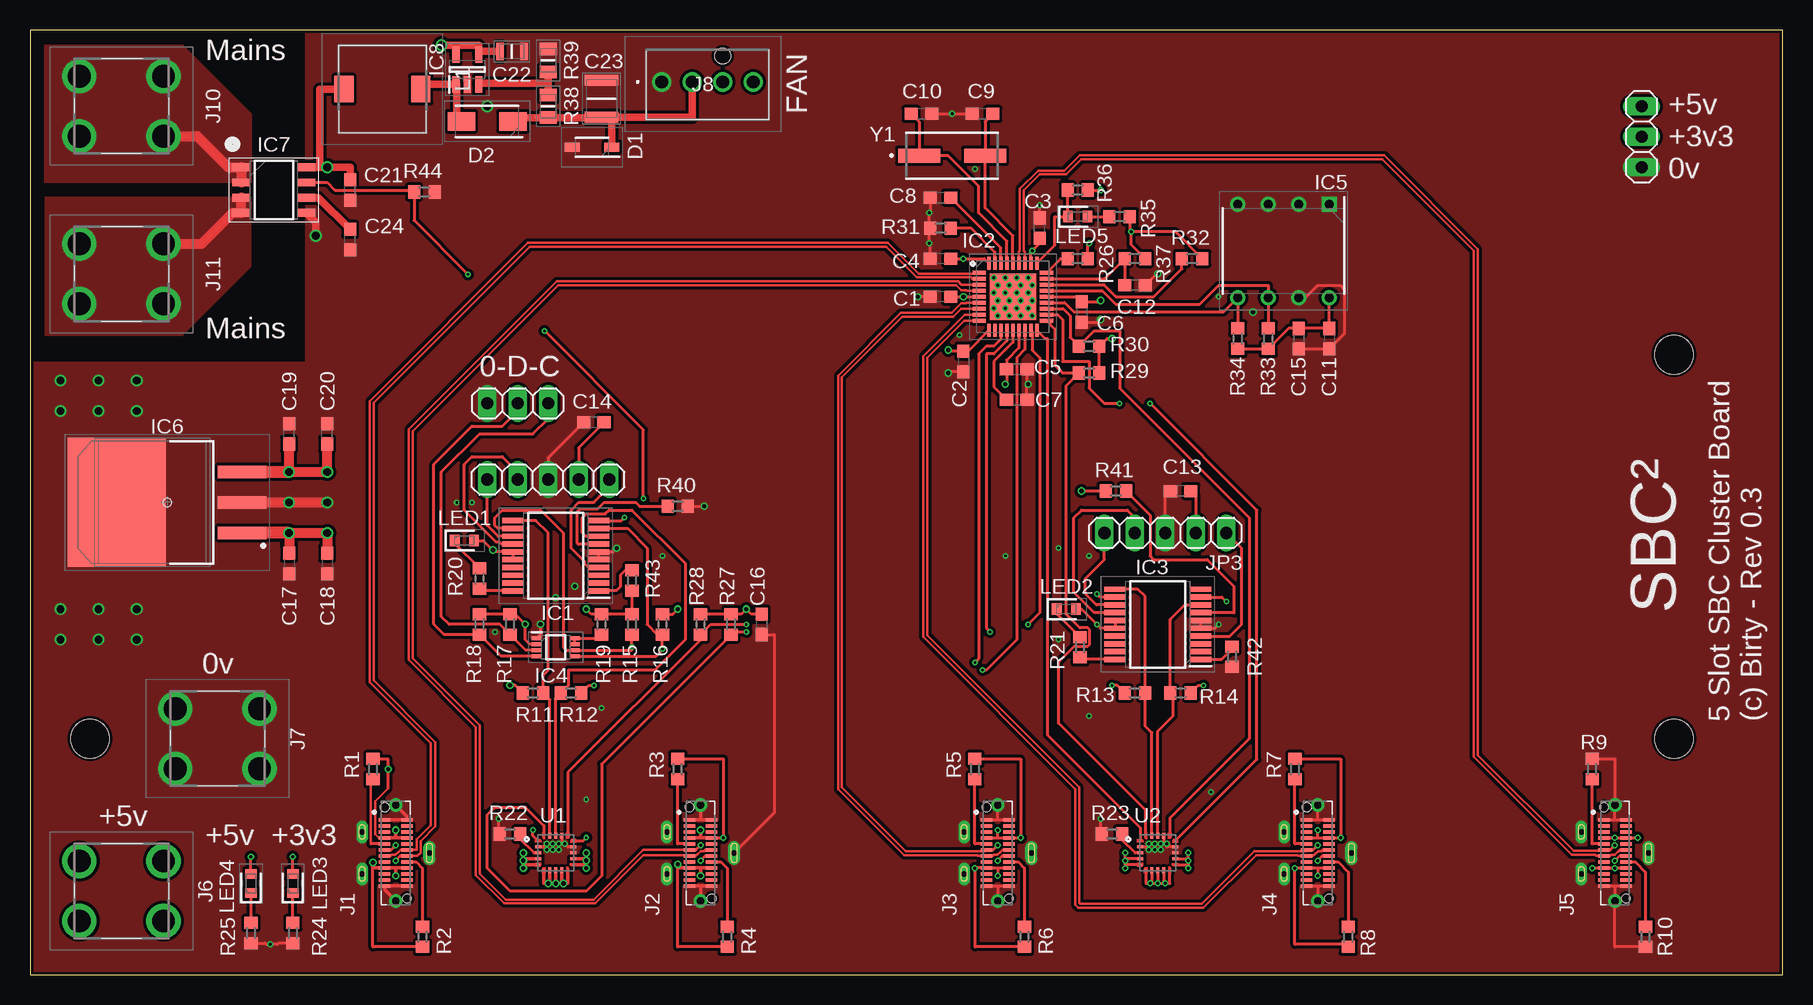
[diagram p2: board, top side]
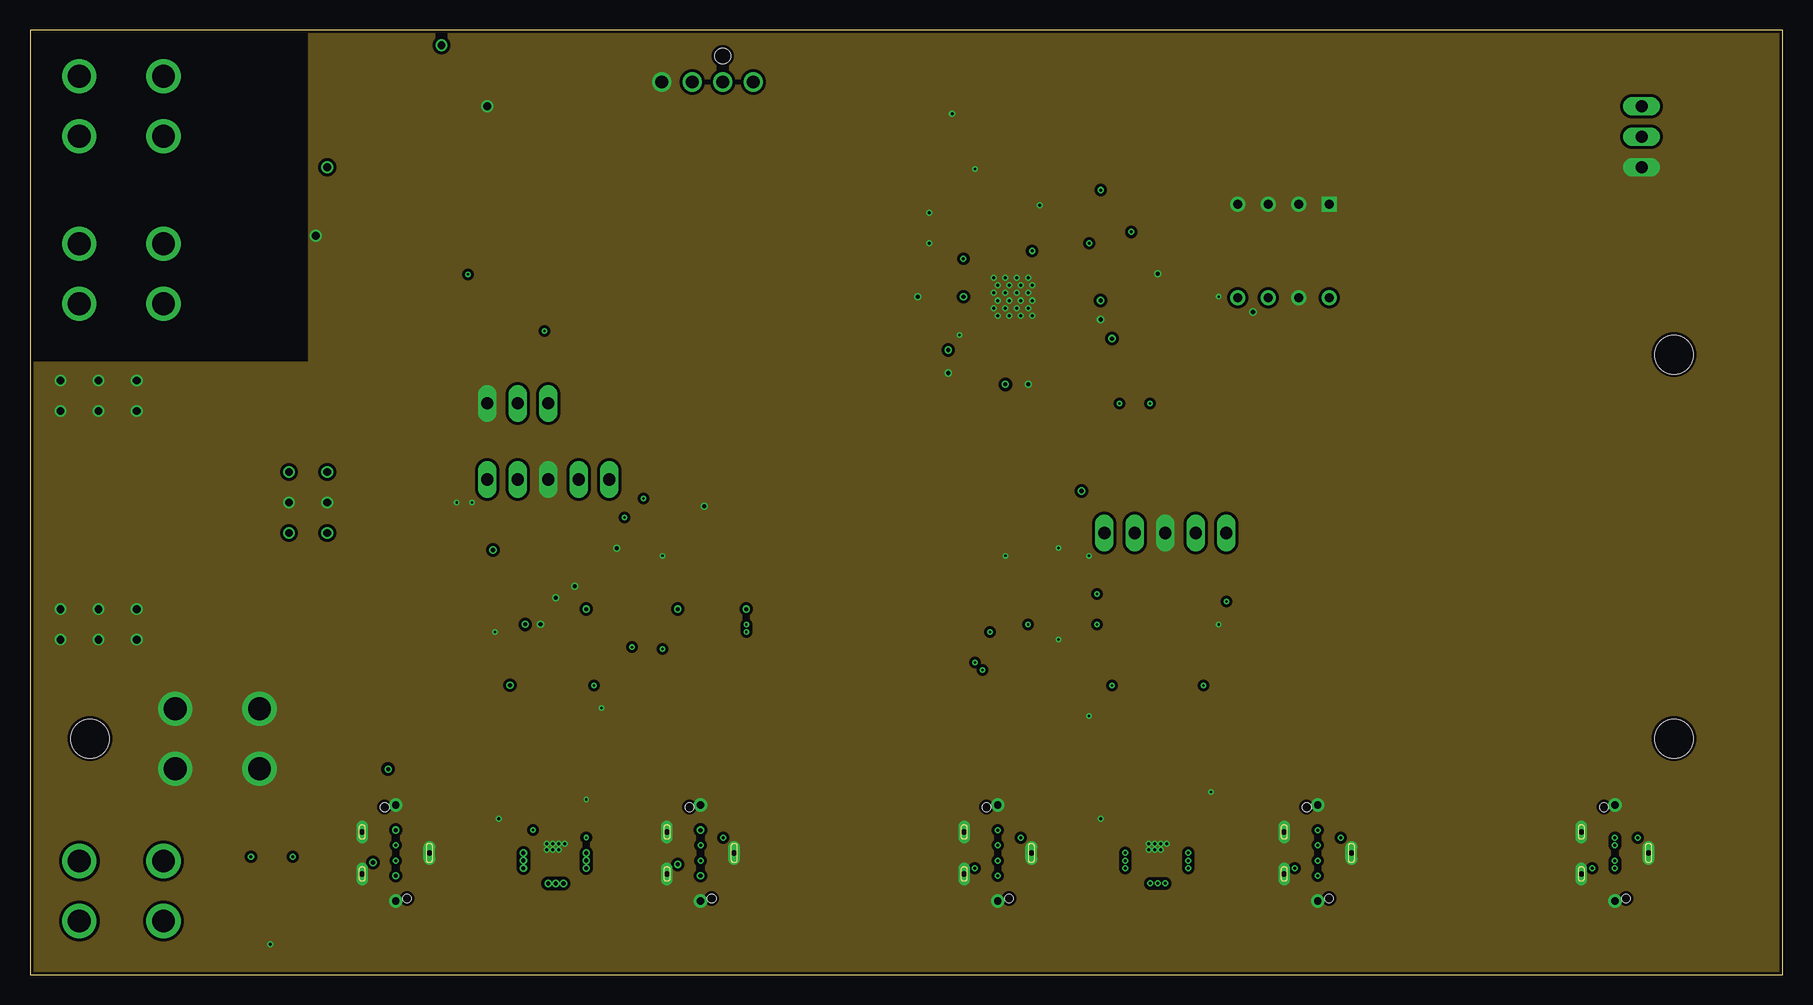
[diagram p3: board, inner layer GND_Plane]
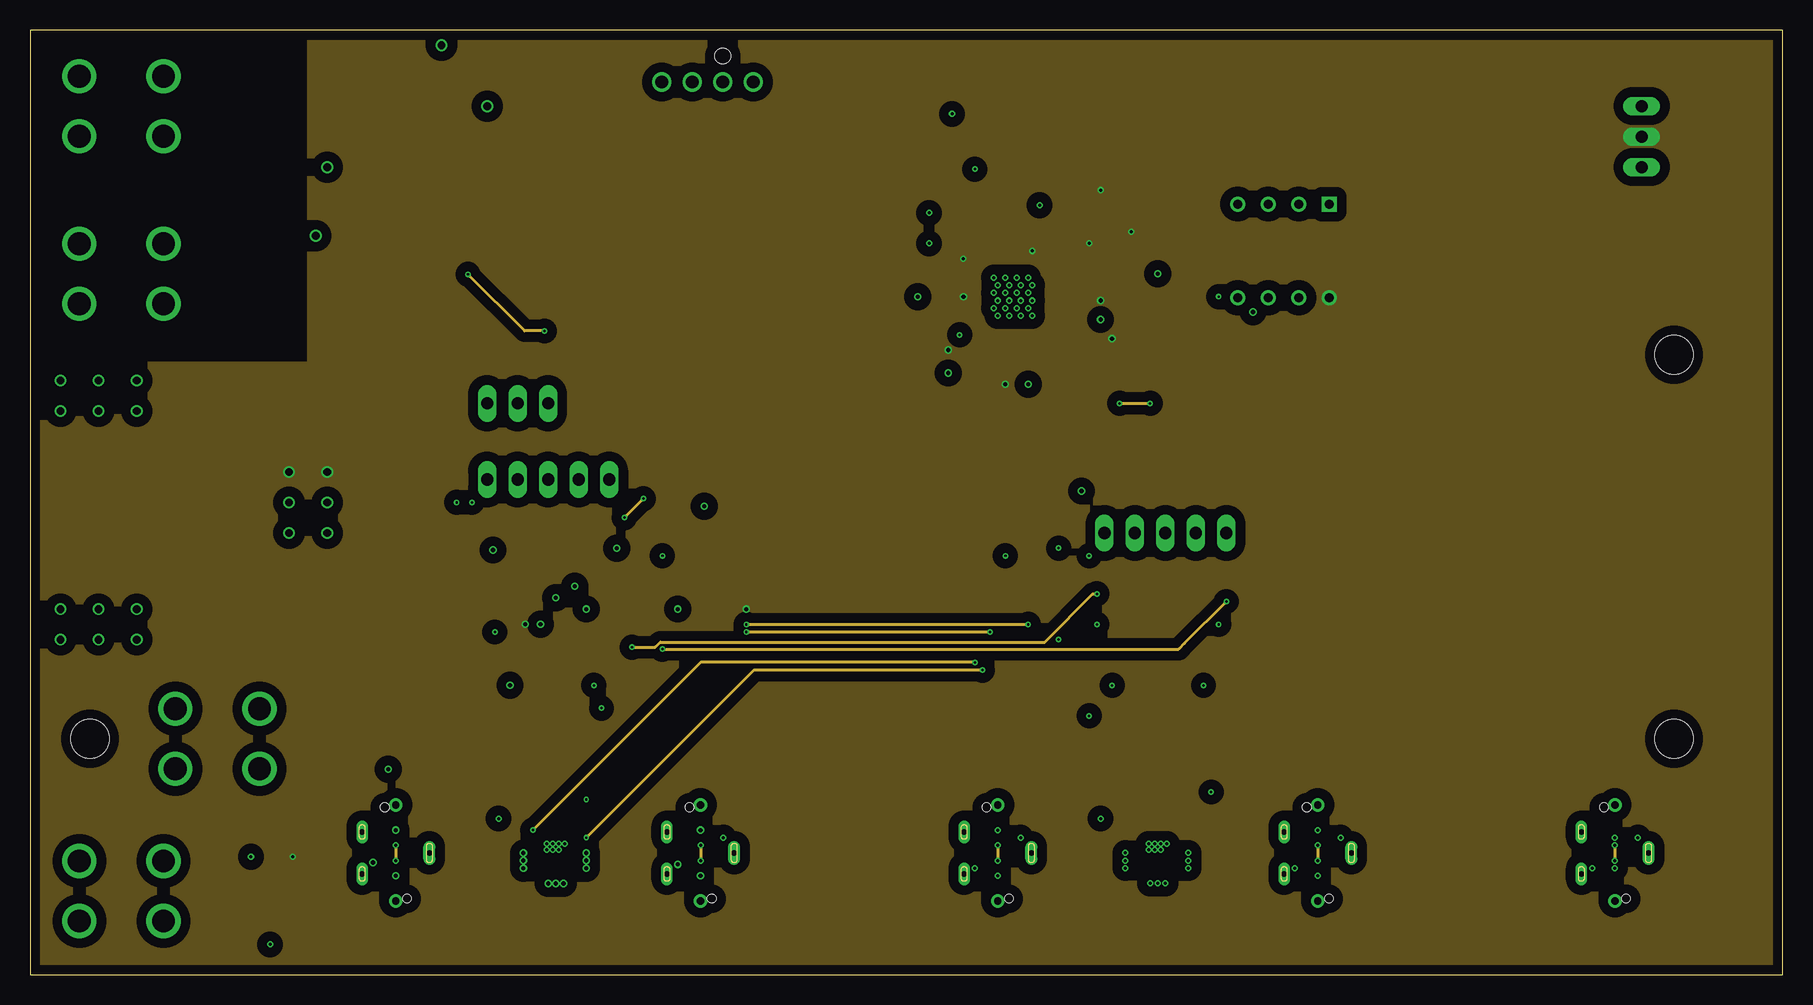
[diagram p4: board, inner layer +3v3_Plane]
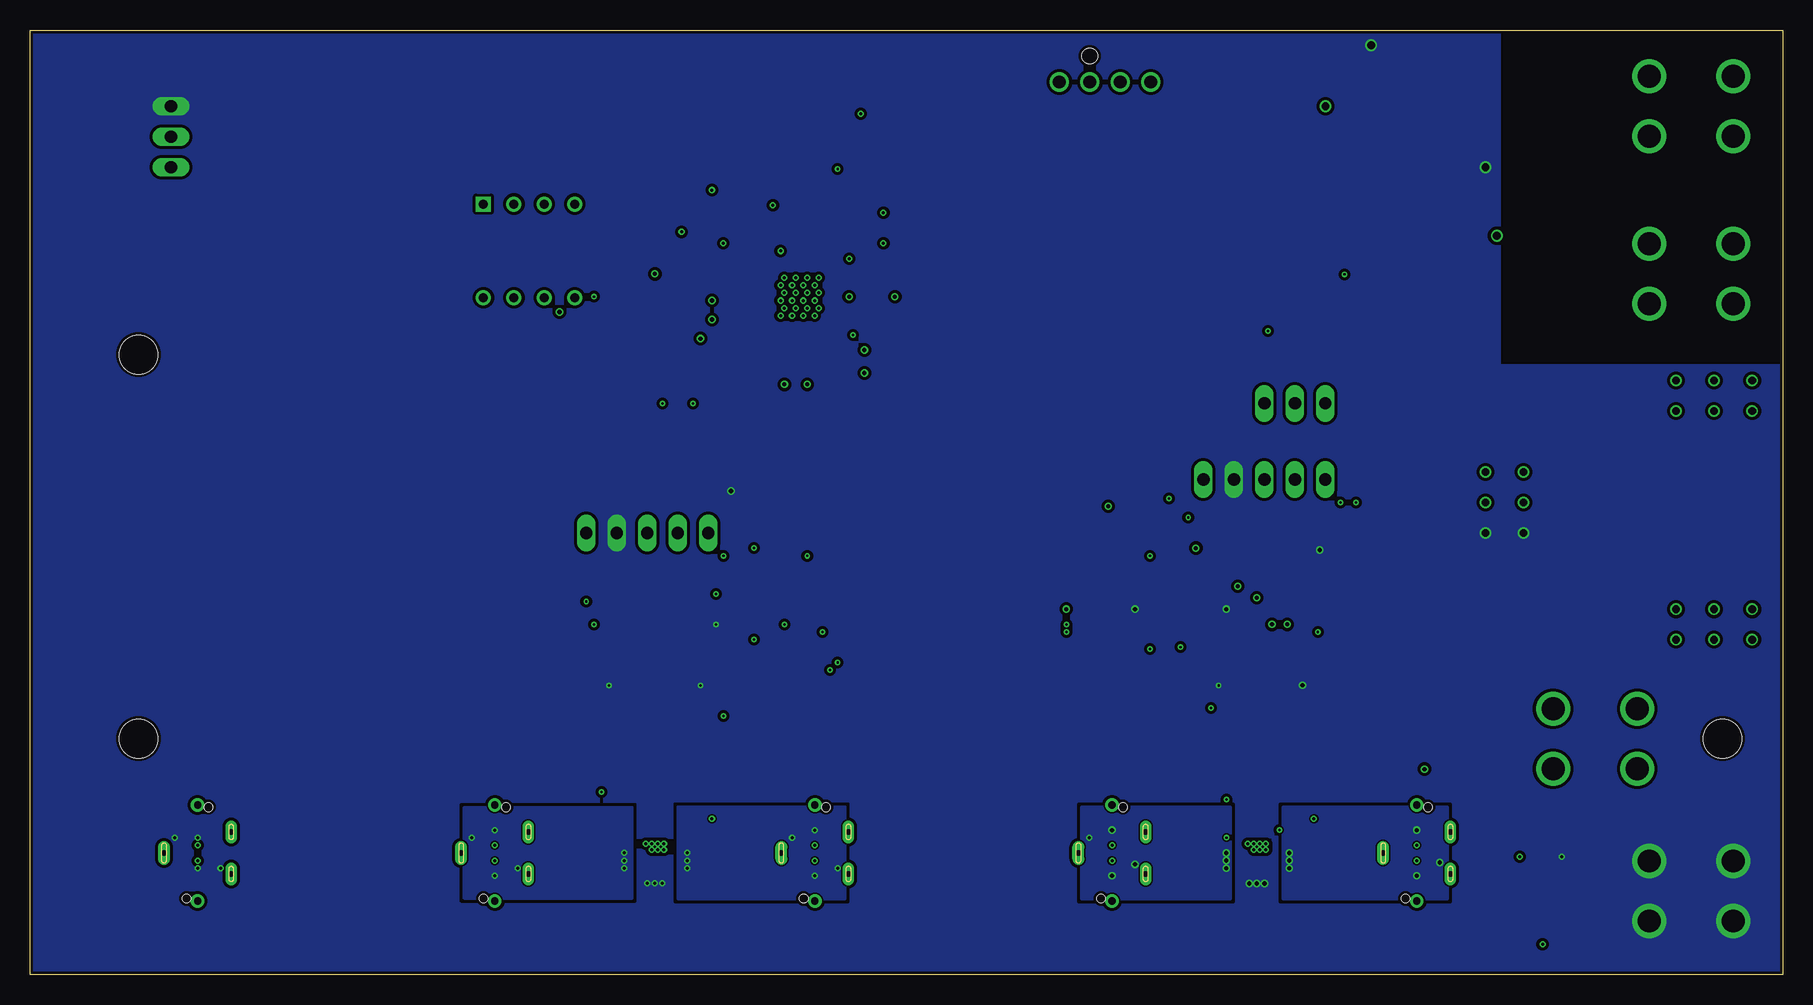
[diagram p5: board, bottom side, seen from below]

Size 146.05 x 78.74 mm. Coordinates in mm from the lower left corner, seen from the top.
Outline: 0,0 146.05,0 146.05,78.74 0,78.74 0,0
Copper layers (1+2*15+16): Top 0.035mm / dielectric 0.2mm / GND_Plane 0.0175mm / dielectric 1.065mm / +3v3_Plane 0.0175mm / dielectric 0.2mm / +5v_Plane 0.035mm
Design rules "jlcpcb4layerdefinedimped *": minimum track width 3.5mil, minimum drill 0.2mm, track to track 5mil, track to pad 5mil, pad to pad 5mil, via to via 5mil, smd to smd 5mil, copper to edge 10mil, drill to drill 5mil, minimum pad ring 10mil, minimum via ring 5mil, stop-mask expansion 4mil, vias tented up to drill 0mil, thermal gap 10mil
Holes 3.2 mm at 5,19.68 137,19.68 137,51.68

### Footprints (pad centres in the part's own frame; a part is rotated, then mirrored left to right if it is on the bottom)
C0603 = smd 1.1 x 1: 1 -0.85,0; 2 0.85,0
CAPC2012X145N = smd 0.62 x 1.47: 1 -1,0; 2 1,0
CAPC3225X230N = smd 0.92 x 2.82: 1 -1.54,0; 2 1.54,0
SOD3716X115N = smd 1.25 x 0.75: 1 -1.65,0; 2 1.65,0
DIOM5226X220N = smd 2.3 x 1.55: 1 -2.15,0; 2 2.15,0
SOP65P780X200-20N = smd 1.8 x 0.45: 1 -3.55,2.925; 2 -3.55,2.275; 3 -3.55,1.625; 4 -3.55,0.975; 5 -3.55,0.325; 6 -3.55,-0.325; 7 -3.55,-0.975; 8 -3.55,-1.625; 9 -3.55,-2.275; 10 -3.55,-2.925; 11 3.55,-2.925; 12 3.55,-2.275; 13 3.55,-1.625; 14 3.55,-0.975; 15 3.55,-0.325; 16 3.55,0.325; 17 3.55,0.975; 18 3.55,1.625; 19 3.55,2.275; 20 3.55,2.925
QFN50P600X600X100-37N = smd 1.1 x 0.3: 1 -2.8,2; 2 -2.8,1.5; 3 -2.8,1; 4 -2.8,0.5; 5 -2.8,0; 6 -2.8,-0.5; 7 -2.8,-1; 8 -2.8,-1.5; 9 -2.8,-2; 19 2.8,-2; 20 2.8,-1.5; 21 2.8,-1; 22 2.8,-0.5; 23 2.8,0; 24 2.8,0.5; 25 2.8,1; 26 2.8,1.5; 27 2.8,2 | smd 0.3 x 1.1: 10 -2,-2.8; 11 -1.5,-2.8; 12 -1,-2.8; 13 -0.5,-2.8; 14 0,-2.8; 15 0.5,-2.8; 16 1,-2.8; 17 1.5,-2.8; 18 2,-2.8; 28 2,2.8; 29 1.5,2.8; 30 1,2.8; 31 0.5,2.8; 32 0,2.8; 33 -0.5,2.8; 34 -1,2.8; 35 -1.5,2.8; 36 -2,2.8 | smd 3.8 x 3.8: 37 0,0
SOP50P310X90-8N = smd 0.85 x 0.3: 1 -1.575,0.75; 2 -1.575,0.25; 3 -1.575,-0.25; 4 -1.575,-0.75; 5 1.575,-0.75; 6 1.575,-0.25; 7 1.575,0.25; 8 1.575,0.75
DIP781W56P254L950H533Q8N = drill 0.759 pad 1.159 square: 1 -3.905,3.81 | drill 0.759 pad 1.159: 2 -3.905,1.27; 3 -3.905,-1.27; 4 -3.905,-3.81; 5 3.905,-3.81; 6 3.905,-1.27; 7 3.905,1.27; 8 3.905,3.81
TO254P1491X508-4N = smd 4.05 x 1.05: 1 -6.25,2.54; 2 -6.25,0; 3 -6.25,-2.54 | smd 8.2 x 10.75: 4 4.2,0
SOIC127P600X175-8N = smd 1.5 x 0.65: 1 -2.7,1.905; 2 -2.7,0.635; 3 -2.7,-0.635; 4 -2.7,-1.905; 5 2.7,-1.905; 6 2.7,-0.635; 7 2.7,0.635; 8 2.7,1.905
SOT95P270X145-5N = smd 1.4 x 0.6: 1 -1.25,0.95; 2 -1.25,0; 3 -1.25,-0.95; 4 1.25,-0.95; 5 1.25,0.95
RENHOTEC_RHT-692-1312 = smd 0.28 x 0.95: A1 2.75,0.925; A2 2.25,0.925; A3 1.75,0.925; A4 1.25,0.925; A5 0.75,0.925; A6 0.25,0.925; A7 -0.25,0.925; A8 -0.75,0.925; A9 -1.25,0.925; A10 -1.75,0.925; A11 -2.25,0.925; A12 -2.75,0.925; B1 -2.75,-0.925; B2 -2.25,-0.925; B3 -1.75,-0.925; B4 -1.25,-0.925; B5 -0.75,-0.925; B6 -0.25,-0.925; B7 0.25,-0.925; B8 0.75,-0.925; B9 1.25,-0.925; B10 1.75,-0.925; B11 2.25,-0.925; B12 2.75,-0.925 | drill 0.6 pad 0.9: S1 4.005,0; S4 -4.005,0 | drill 0.45 pad 0.8 long: S2 1.75,2.8; S3 -1.75,2.8 | drill 0.45 pad 1 long: S5 0,-2.8 | hole 0.7: -3.81,-0.93; 3.81,0.92
7691 = drill 1.9 pad 2.85: 1 -2.5,3.505; 2 2.5,3.505; 3 2.5,-3.505; 4 -2.5,-3.505
470533000 = drill 1.07 pad 1.605: 1 0,0; 2 -2.54,0; 3 -5.08,0; 4 -7.62,0 | hole 1.3: -5.08,-2.16
1X03 = drill 1.016 long: 1 -2.54,0; 2 0,0; 3 2.54,0
1X05 = drill 1.016 long: 1 -5.08,0; 2 -2.54,0; 3 0,0; 4 2.54,0; 5 5.08,0
744778004 = smd 2.2 x 1.6: 1 0,3.2; 2 0,-3.2
LEDC1608X85N = smd 0.8 x 0.95: 1 -0.8,0; 2 0.8,0
R0603 = smd 1 x 1.1: 1 -0.85,0; 2 0.85,0
RESC2012X70N = smd 1.05 x 1.4: 1 -0.95,0; 2 0.95,0
IC_UCS2114-1-V/LX = smd 0.1 x 0.1: 1 -1.45,1; 5 -1.4,-1; 6 -1,-1.45; 10 1,-1.5; 11 1.45,-1; 15 1.45,1; 16 1,1.5; 20 -1,1.5 | smd 0.5 x 0.25: 2 -1.45,0.5; 3 -1.45,0; 4 -1.45,-0.5; 12 1.45,-0.5; 13 1.45,0; 14 1.45,0.5 | smd 0.25 x 0.5: 7 -0.5,-1.45; 8 0,-1.45; 9 0.5,-1.45; 17 0.5,1.45; 18 0,1.45; 19 -0.5,1.45
ABLS7M2 = smd 3.5 x 1.2: 1 -2.75,0; 2 2.75,0

### Placement (x,y rotation side)
C1  75.88,56.51 180 top
C2  77.79,51.12 270 top
C3  84.14,62.23 90 top
C4  75.88,59.69 180 top
C5  82.23,50.48 0 top
C6  87.63,55.24 270 top
C7  82.23,47.94 0 top
C8  75.88,64.77 0 top
C9  79.38,71.75 180 top
C10  74.3,71.75 180 top
C11  108.27,53.02 270 top
C12  92.08,57.47 180 top
C13  95.89,40.32 180 top
C14  46.99,46.04 180 top
C15  105.73,53.02 270 top
C16  60.96,29.21 270 top
C17  21.59,34.29 270 top
C18  24.77,34.29 270 top
C19  21.59,45.09 90 top
C20  24.77,45.09 90 top
C21  26.67,65.41 90 top
C22  40.15,76.96 180 top
C23  47.62,73.03 270 top
C24  26.67,61.28 90 top
D1  46.84,68.98 180 top
D2  38.1,71.12 180 top
IC1  43.81,34.92 180 top
IC2  81.92,56.51 0 top
IC3  93.98,29.21 180 top
IC4  43.81,27.3 0 top
IC5  104.46,60.32 270 top
IC6  11.43,39.37 180 top
IC7  20.32,65.41 0 top
IC8  36.45,75.45 90 top
J1  30.48,10.16 90 top
J2  55.88,10.16 90 top
J3  80.64,10.16 90 top
J4  107.31,10.16 90 top
J5  132.08,10.16 90 top
J6  7.62,6.98 270 top
J7  15.62,19.69 270 top
J8  52.65,74.41 180 top
J10  7.62,72.39 270 top
J11  7.62,58.42 270 top
JP1  134.3,69.85 90 top
JP2  43.18,41.27 180 top
JP3  94.61,36.83 180 top
JP4  40.64,47.62 0 top
L1  29.37,73.82 90 top
LED1  36.2,36.2 0 top
LED2  86.36,30.48 0 top
LED3  21.91,7.62 90 top
LED4  18.41,7.62 90 top
LED5  87.31,63.18 0 top
R1  28.57,17.15 90 top
R2  32.7,3.18 270 top
R3  53.98,17.15 90 top
R4  58.1,3.18 270 top
R5  78.74,17.15 90 top
R6  82.87,3.18 270 top
R7  105.41,17.15 90 top
R8  109.86,3.18 270 top
R9  130.18,17.15 270 top
R10  134.62,3.18 90 top
R11  41.91,23.49 180 top
R12  45.09,23.49 0 top
R13  92.08,23.49 180 top
R14  95.89,23.49 0 top
R15  50.16,29.21 90 top
R16  52.7,29.21 90 top
R17  40.01,29.21 90 top
R18  37.47,29.21 90 top
R19  47.62,29.21 90 top
R20  37.47,33.02 90 top
R21  87.5,27.3 90 top
R22  40.01,11.75 0 top
R23  90.17,11.75 0 top
R24  21.91,3.49 90 top
R25  18.41,3.49 90 top
R26  87.31,59.69 0 top
R27  58.42,29.21 90 top
R28  55.88,29.21 90 top
R29  88.27,50.16 0 top
R30  88.27,52.39 0 top
R31  75.88,62.23 180 top
R32  96.84,59.69 0 top
R33  103.19,53.02 270 top
R34  100.65,53.02 270 top
R35  90.81,63.18 180 top
R36  87.31,65.41 180 top
R37  92.08,59.69 0 top
R38  43.18,72.39 270 top
R39  43.18,76.2 270 top
R40  53.98,39.05 0 top
R41  90.49,40.32 180 top
R42  100.17,26.51 90 top
R43  50.16,32.86 90 top
R44  32.86,65.25 0 top
U1  43.81,10.16 0 top
U2  93.98,10.16 0 top
Y1  76.83,68.26 0 top

### Tracks (layer width: path | path; a pad name or v marks a point on that pad's centre or on a via)
+3V3  (via drill 0.25, 0.35, 0.65)
  Top 0.254: LED3.2 v21.91,9.84 | IC2.29 83.42,60.24 v83.5,60.32 84.14,60.96 C3.1 | R36.1 v89.22,65.41 | R26.2 88.16,60.86 v88.27,60.96 | R35.1 91.66,62.01 v91.76,61.91 | C4.1 v77.79,59.69 79.54,59.69 IC2.36 | R37.2 91.76,60.86 v91.76,61.91 | R32.2 95.47,61.91 v91.76,61.91 | IC2.23 87.21,56.51 C6.1 89.11,56.1 v89.22,56.2 | R34.2 R33.2 | R33.2 103.5,52.17 | 107.75,56.42 IC5.8 C11.1 C15.1 104.89,53.87 R33.2 | R29.2 R30.2 89.75,53.02 v90.17,53.02 | IC2.15 82.42,52.25 81.38,51.22 C5.1 81.38,49.32 v81.28,49.21 | IC2.10 78.17,51.97 C2.1 76.62,51.97 v76.52,52.07 | C1.1 v77.79,56.51 IC2.5 | IC4.2 41.66,27.55 41.27,27.94 v41.27,29.21 40.42,30.06 R17.2 R18.2 | R28.2 R27.2 59.27,30.06 v59.69,30.48 60.11,30.06 C16.1
  Top 0.813: v21.59,41.91 21.74,41.91 | v21.59,41.91 C19.1 | v21.59,41.91 v24.77,41.91 C20.1
  Top 1.016: IC6.3 v21.59,41.91
  pour +3v3_Plane (isolate 0.813, no thermals): -3.17,50.67 -3.17,-1.27 146.05,-1.27 146.05,79.38 23.47,79.38 23.47,50.67
+5V  (via drill 0.2, 0.25, 0.35, 0.65)
  Top 0.254: U2.6 92.98,7.62 v93.34,7.62 93.48,7.62 | U2.10 94.98,7.62 v94.61,7.62 94.48,7.62 | 93.48,7.62 v93.98,7.62 | v93.98,7.62 94.48,7.62 | U2.7 93.48,7.62 | U2.8 v93.98,7.62 | U2.9 94.48,7.62 | J5.A4 J5.B9 133.99,11.41 v133.99,11.43 | J5.B4 J5.A9 131.13,8.89 v130.18,8.89 | LED4.2 v18.41,9.84 | v46.35,30.48 46.77,30.06 R19.2 R15.2 R43.1 | R11.2 40.42,24.13 v40.01,24.13 | IC1.16 IC1.15 38.73,35.25 v38.58,35.4 37.78,36.2 LED1.2 | R16.2 53.55,30.06 v53.98,30.48 | IC3.15 IC3.16 89.22,28.88 v88.9,29.21 87.63,30.48 LED2.2 | R12.2 46.57,24.13 v46.99,24.13 | R13.2 90.59,24.13 v90.17,24.13 | R14.2 97.37,24.13 v97.79,24.13 | C13.1 97.16,39.9 JP3.2 | C14.1 45.72,43.92 JP2.2 | R41.2 v87.63,40.32
  Top 0.305: U1.6 42.81,7.62 v43.18,7.62 43.31,7.62 | U1.10 44.81,7.62 v44.45,7.62 44.31,7.62 | 44.31,7.62 v43.81,7.62 | v43.81,7.62 43.31,7.62 | U1.9 44.31,7.62 | U1.8 v43.81,7.62 | U1.7 43.31,7.62
  Top 0.61: IC7.8 v24.77,67.31 | v24.77,67.31 26.67,67.31 C21.2 | v24.77,67.31 24.13,67.31 24.13,73.79 24.15,73.82 L1.1 | v34.29,77.47 35.49,77.47 | 35.49,77.47 IC8.5 | 35.49,77.47 37.4,77.47 IC8.4 37.4,76.96 C22.2
  Top 0.813: C18.1 v24.77,36.83 v21.59,36.83 C17.1
  Top 1.016: v21.59,36.83 IC6.1
  other vias: 132.08,11.43 132.08,8.89
  pour +5v_Plane (isolate 0.254, rank 6, no thermals): -1.27,50.6 -1.27,-1.91 161.29,-1.91 161.29,80.65 23.77,80.65 23.77,50.6
DOWN1_N
  Top 0.203: IC2.1 79.05,58.45 74.05,58.45 71.48,61.01 41.49,61.01 28.3,47.82 28.3,24.41 33.39,19.32 33.39,12.46 32.22,11.29 32.22,10.41 J1.B7 30.89,10.41 30.74,10.27 30.72,10.27 30.46,10.01 30.28,10.01 30.28,10 30.16,10 30.07,9.91 J1.A7
DOWN1_P  (via drill 0.25)
  Top 0.203: IC2.2 78.51,58.01 78.41,58.12 73.91,58.12 71.35,60.68 41.63,60.68 28.63,47.68 28.63,24.54 33.77,19.41 33.77,12.37 32.55,11.16 32.55,10.18 32.29,9.91 J1.B6
  Top 0.254: J1.A6 30.09,10.41 v30.48,10.79 | J1.B6 30.86,9.91 v30.48,9.52
  +3v3_Plane 0.254: v30.48,10.79 v30.48,9.52
DOWN2_N
  Top 0.203: IC2.3 77.61,57.51 77.34,57.79 43.88,57.79 31.55,45.46 31.55,26.26 37.16,20.65 37.16,8.3 39.51,5.95 47.1,5.95 51.12,9.97 54.9,9.97 J2.A7 55.47,9.91 55.62,10.05 55.64,10.05 55.9,10.31 56.08,10.31 56.08,10.32 56.2,10.32 56.29,10.41 J2.B7
DOWN2_P  (via drill 0.25)
  Top 0.203: J2.A6 51.09,10.41 46.96,6.28 39.65,6.28 37.49,8.43 37.49,20.79 31.88,26.4 31.88,45.32 44.02,57.46 77.21,57.46 77.61,57.05 78.01,57.05 78.04,57.01 IC2.4 | J2.B6 56.27,9.91
  Top 0.254: J2.A6 55.49,10.41 v55.88,10.79 | 56.27,9.91 v55.88,9.52
  +3v3_Plane 0.254: v55.88,10.79 v55.88,9.52
DOWN3_N
  Top 0.203: IC2.6 78.04,56.01 78.01,55.98 77.61,55.98 76.8,55.17 72.56,55.17 67.33,49.95 67.33,15.48 72.86,9.96 78.94,9.96 78.99,9.91 J3.A7 80.24,9.91 80.33,10 80.44,10 80.45,10.01 80.62,10.01 80.88,10.27 80.91,10.27 81.05,10.41 J3.B7
DOWN3_P  (via drill 0.25)
  Top 0.203: IC2.7 77.61,55.51 76.94,54.84 72.69,54.84 67.67,49.81 67.67,15.62 73,10.29 79.6,10.29 J3.A6
  Top 0.254: J3.A6 80.26,10.41 v80.64,10.79 | J3.B6 81.03,9.91 v80.64,9.52
  +3v3_Plane 0.254: v80.64,10.79 v80.64,9.52
DOWN4_N
  Top 0.203: IC2.8 77.89,55.01 74.42,51.55 74.42,28.16 87.1,15.48 87.1,5.86 87.37,5.59 97.77,5.59 102.17,9.98 105.61,9.98 105.69,9.91 J4.A7 106.91,9.91 107.05,10.05 107.08,10.05 107.34,10.31 107.51,10.31 107.52,10.32 107.63,10.32 107.72,10.41 J4.B7
DOWN4_P  (via drill 0.25)
  Top 0.203: IC2.9 77.86,54.51 74.75,51.41 74.75,28.3 87.43,15.62 87.43,5.99 87.5,5.92 97.64,5.92 102.03,10.31 106.29,10.31 J4.A6
  Top 0.254: J4.A6 106.93,10.41 v107.31,10.79 | J4.B6 107.7,9.91 v107.31,9.52
  +3v3_Plane 0.254: v107.31,10.79 v107.31,9.52
GND  (via drill 0.2, 0.25, 0.35, 0.65)
  Top 0.254: U1.2 42.79,10.66 v43.05,10.92 | U1.14 44.84,10.66 v44.58,10.92 44.31,11.18 U1.17 | J4.A1 107.31,12.91 | 107.31,12.91 J4.B12 | J4.A12 107.31,7.41 | 107.31,7.41 J4.B1 | 107.31,12.91 J4.S1 | 107.31,7.41 J4.S4 | J3.A12 80.64,7.41 | 80.64,7.41 J3.B1 | 80.64,7.41 J3.S4 | J3.A1 80.64,12.91 | 80.64,12.91 J3.B12 | 80.64,12.91 J3.S1 | U2.2 93.22,10.66 v93.22,10.41 | U2.17 94.48,10.92 v94.23,10.92 | U2.14 94.74,10.66 v94.74,10.92 | J5.A1 132.08,12.91 | 132.08,12.91 J5.B12 | 132.08,12.91 J5.S1 132.08,17.99 R9.1 | J5.A12 132.08,7.41 | 132.08,7.41 J5.B1 | 132.08,7.41 J5.S4 132.08,2.32 R10.1 | R22.1 39.05,11.85 v39.05,13.02 | R23.1 89.22,11.85 v89.22,13.02 | R25.1 19.58,2.64 19.68,2.54 v20,2.54 20.64,2.54 20.74,2.64 R24.1 | C8.1 75.03,63.6 v74.93,63.5 74.93,62.33 R31.2 74.93,62.13 v74.93,60.96 75.03,60.86 C4.2 | C10.1 v76.83,71.75 C9.2 | C3.2 v84.14,64.13 | C6.2 89,54.4 v89.22,54.61 | IC5.7 106.27,56.42 107.31,57.47 109.22,57.47 109.54,57.15 109.54,53.44 C11.2 C15.2 | C12.1 93.88,58.42 v93.98,58.42 | C5.2 83.08,49.32 v83.19,49.21 83.08,49.11 C7.2 | C2.2 76.62,50.27 v76.52,50.16 | C1.2 v73.98,56.51 | IC4.1 42.55,28.36 v42.55,29.21 | IC1.5 IC1.6 48.59,35.25 v48.9,35.56 | IC3.6 IC3.5 98.73,28.88 v99.06,29.21 | JP3.3 94.61,39.9 C13.2 | C14.2 43.18,43.08 JP2.3 | IC2.37 v81.6,56.2 | C16.2 62.02,28.36 62.02,13.49 J2.S5 | R40.2 v56.2,39.05
  Top 0.305: J1.A1 J1.B12 31.41,13.24 J1.S1 | J1.B1 J1.A12 29.55,7.08 J1.S4 | J2.A1 55.88,12.91 | 55.88,12.91 J2.B12 | 55.88,12.91 J2.S1 | J2.A12 55.88,7.41 | 55.88,7.41 J2.B1 | 55.88,7.41 J2.S4
  Top 0.61: IC7.5 23.81,62.71 v23.81,61.6
  Top 0.813: IC6.2 v21.59,39.37 v24.77,39.37
  other vias: 2.54,49.53 2.54,46.99 5.71,46.99 5.71,49.53 8.89,49.53 8.89,46.99 2.54,30.48 2.54,27.94 5.71,30.48 5.71,27.94 8.89,30.48 8.89,27.94 43.56,10.92 43.05,10.41 43.56,10.41 44.07,10.41 44.07,10.92 93.73,10.92 93.22,10.92 93.73,10.41 94.23,10.41 80.33,58.1 81.28,58.1 82.23,58.1 83.19,58.1 83.5,57.47 82.55,57.47 81.6,57.47 80.64,57.47 80.33,56.83 81.28,56.83 82.23,56.83 83.19,56.83 83.5,56.2 82.55,56.2 80.64,56.2 80.33,55.56 81.28,55.56 82.23,55.56 83.19,55.56 83.5,54.93 82.55,54.93 81.6,54.93 80.64,54.93 88.27,21.59 52.7,34.92 46.35,14.6 98.42,15.24 85.72,27.94 88.27,34.92 85.72,35.56 77.47,53.34 99.06,56.51 78.74,67.15 36.83,39.37 38.73,28.58 47.62,22.23 81.28,34.92 35.56,39.37 101.92,55.24 38.1,72.39 45.4,32.38 43.81,31.43
  pour GND_Plane (isolate 0.254, no thermals): -0.64,50.8 -0.64,-0.64 161.29,-0.64 161.29,80.65 23.47,80.65 23.47,50.8
  pour Top (isolate 0.254, no thermals): 0,50.8 26.04,50.8 26.04,-1.42 0,-1.42
  pour Top (no thermals): 42.8,11.18 42.8,10.16 44.83,10.16 44.83,11.18
  pour Top (no thermals): 93.03,11.11 94.93,11.11 94.93,10.16 93.03,10.16
  pour Top (no thermals): 93.03,11.11 94.93,11.11 94.93,10.16 93.03,10.16
  pour Top (isolate 0.254, no thermals): 23.04,83.19 23.04,-1.27 148.59,-1.27 148.59,83.19
N$1  (via drill 0.2)
  Top 0.254: IC7.7 24.77,66.04 25.4,65.41 31.85,65.41 R44.1 32.01,62.87 v36.5,58.38 | IC1.10 49.28,37.85 v49.53,38.1 | v51.12,39.69 51.12,45.41 v42.88,53.66
  +3v3_Plane 0.254: v49.53,38.1 v51.12,39.69 | v42.88,53.66 41.22,53.66 v36.5,58.38
N$2
  Top 0.61: D2.2 35.56,71.12 35.56,74.2 IC8.1 32.95,74.2 L1.2
N$3
  Top 0.61: D2.1 40.25,71.44 R38.2 47.62,71.44 C23.2 | J8.2 55.19,71.49 C23.2 | D1.1 48.49,71.49 C23.2
N$4
  Top 0.61: IC8.3 37.4,74.29 43.18,74.29 | R39.2 43.18,74.29 | 43.18,74.29 R38.1
N$5
  Top 0.61: IC7.6 24.03,64.77 C24.2
N$6
  Top 0.254: IC1.7 47.34,35.88 45.72,35.88 45.62,35.97 45.62,38.58 45.88,38.83 47.31,38.83 47.85,39.37 50.48,39.37 50.8,39.05 R40.1
N$7
  Top 0.254: R41.1 93.34,38.31 93.34,34.92 93.66,34.61 98.11,34.61 100.33,32.38 100.33,30.16 97.55,30.16 IC3.7
N$8
  Top 0.254: IC3.1 99.31,26.28 100.17,27.15 R42.2
N$10
  Top 0.254: IC1.1 47.43,32.07 48.9,32.07 49.21,32.38 49.21,33.34 49.59,33.71 R43.2
N$11
  Top 0.254: J5.A5 130.18,10.91 R9.2
N$12
  Top 0.254: J5.B5 133.78,9.41 134.62,8.57 R10.2
N$13
  Top 0.254: U1.19 43.31,22.94 R11.1 42.76,24.98 43.18,25.4 43.18,36.83 42.16,37.85 IC1.11
N$14
  Top 0.254: IC2.27 85.89,59.69 R26.1
N$15
  Top 0.254: J2.A5 53.98,10.91 R3.1
N$16
  Top 0.254: J2.B5 57.58,9.41 58.1,8.89 R4.1
N$17
  Top 0.203: 28.42,16.14 28.42,10.91
  Top 0.254: J1.A5 28.42,10.91 | 28.42,16.14 R1.1
N$18
  Top 0.254: J1.B5 32.18,9.41 32.7,8.89 R2.1
N$19
  Top 0.254: J4.A5 105.41,10.91 R7.1
N$20
  Top 0.254: J4.B5 109.02,9.41 109.86,8.57 R8.1
N$21  (via drill 0.35)
  Top 0.203: 29.84,15.56 28.76,14.47 28.76,11.72 29.07,11.41
  Top 0.254: J1.B9 31.41,11.43 | R1.2 29.84,17.99 v29.84,17.15 29.84,15.56 | R2.2 28.57,2.32 28.57,8.91 | J1.A4 29.07,11.41
  Top 0.305: J1.B9 30.48,11.41 | 30.48,11.41 J1.A4 | 30.48,8.91 J1.B4 31.41,8.89 | 30.48,8.91 J1.A9 28.57,8.91 v28.57,9.37 | U1.4 41.12,9.66 | U1.5 41.12,9.16 | 41.12,9.66 v41.12,9.52 41.12,9.16 | 41.12,9.66 v41.12,10.16 | 41.12,9.16 v41.12,8.89 | 30.48,11.41 v30.48,12.06 | 30.48,8.91 v30.48,8.25
  pour +5v_Plane (rank 2): 41.59,6.35 27.94,6.35 27.94,13.97 41.59,13.97
N$22  (via drill 0.25, 0.35)
  Top 0.254: R4.2 53.98,2.32 53.98,8.91 | J2.B9 56.8,11.43 v57.78,11.43 57.78,17.99 R3.2
  Top 0.305: U1.12 46.35,9.66 | 46.35,9.16 v46.35,9.52 46.35,9.66 | U1.11 46.35,9.16 | 46.35,9.16 v46.35,8.89 | 46.35,9.66 v46.35,10.16 | 55.88,8.91 J2.A9 53.98,8.91 v53.98,9.21 | 55.88,8.91 J2.B4 | J2.A4 55.88,11.41 | 55.88,11.41 J2.B9 | 55.88,11.41 v55.88,12.06 | 55.88,8.91 v55.88,8.25
  pour +5v_Plane: 46.04,13.97 58.42,13.97 58.42,6.35 46.04,6.35
N$23
  Top 0.254: J3.A5 78.74,10.91 R5.1
N$24
  Top 0.254: J3.B5 82.35,9.41 82.87,8.89 R6.1
N$27  (via drill 0.2)
  Top 0.254: IC2.13 81.42,52.84 80.33,51.75 79.69,51.75 79.69,28.89 v80.01,28.58 | U1.20 42.81,12.43 41.27,13.97 38.73,13.97 38.1,13.34 38.1,8.89 40.01,6.98 46.35,6.98 47.62,8.25 47.62,17.56 R27.1 58.63,28.58 v59.69,28.58
  +3v3_Plane 0.254: v59.69,28.58 v80.01,28.58
N$28  (via drill 0.2)
  Top 0.254: IC2.12 80.92,52.98 80.33,52.39 79.69,52.39 79.06,51.75 79.06,26.35 v78.74,26.03 | U1.1 41.91,11.61 v41.91,12.06
  +3v3_Plane 0.254: v78.74,26.03 55.88,26.03 v41.91,12.06
N$29  (via drill 0.2)
  Top 0.254: IC2.16 82.92,52.12 82.23,51.43 82.23,27.94 79.69,25.4 v79.38,25.4 | U1.15 46.09,11.16 v46.35,11.43
  +3v3_Plane 0.254: v79.38,25.4 60.33,25.4 v46.35,11.43
N$30  (via drill 0.2)
  Top 0.254: IC2.17 83.5,53.63 83.5,52.07 84.14,51.43 84.14,30.16 v83.19,29.21 | U1.16 44.81,16.88 55.88,27.94 R28.1 56.73,29.21 v59.69,29.21
  +3v3_Plane 0.254: v59.69,29.21 v83.19,29.21
N$31
  Top 0.254: IC2.18 84.61,53.02 84.77,53.02 84.77,50.8 84.77,50.48 84.77,20 92.53,12.24 U2.1
N$32  (via drill 0.2)
  Top 0.254: IC2.20 85.64,55.01 86.04,54.61 86.04,51.12 88.27,51.12 88.27,48.9 89.53,47.62 v90.81,47.62 | U2.15 102.23,17.96 102.23,38.73 v93.34,47.62
  +3v3_Plane 0.254: v90.81,47.62 v93.34,47.62
N$33
  Top 0.254: IC2.19 85.41,53.82 85.41,50.8 86.04,50.16 R29.1 86.36,49.11 86.36,30.05 87.5,28.91 88.16,28.91 88.31,28.76 88.31,27.55 88.16,27.4 87.04,27.4 85.72,26.09 85.72,20.95 92.98,13.7 U2.20
N$34
  Top 0.254: IC2.21 86.09,55.51 86.68,54.93 86.68,53.12 R30.1 88.69,53.66 90.81,53.66 90.81,48.9 101.6,38.1 101.6,19.69 94.98,13.06 U2.16
N$35
  Top 0.254: U2.19 93.48,20.19 92.92,20.74 R13.1 92.92,31.53 92.33,32.13 IC3.11
N$36
  Top 0.254: U2.18 93.98,20.32 95.25,21.59 95.25,23.28 R14.1 95.03,29.63 96.24,30.84 IC3.8
N$37  (via drill 0.2)
  Top 0.254: IC4.5 52.17,26.55 52.7,27.09 v52.7,27.15 R16.1 52.28,28.36 51.44,29.21 51.44,35.56 49.8,37.2 IC1.9 | IC3.9 99.33,31.48 v99.69,31.12
  +3v3_Plane 0.254: v52.7,27.15 95.72,27.15 96.2,27.62 v99.69,31.12
N$38  (via drill 0.2)
  Top 0.254: R15.1 v50.16,27.3 50.16,27.09 50.13,27.05 IC4.6 44.7,27.05 44.45,27.3 44.45,36.83 42.55,38.73 39.37,38.73 38.73,38.1 38.73,37.46 39,37.2 IC1.12 | IC3.12 89.17,31.48 v88.9,31.75
  +3v3_Plane 0.254: v50.16,27.3 52.1,27.3 52.53,27.73 84.57,27.73 88.58,31.75 v88.9,31.75
N$39
  Top 0.254: IC2.14 81.92,52.71 80.33,51.12 80.33,49 C7.1
N$40
  Top 0.254: U1.18 43.81,23.08 R12.1 44.87,24.13 44.87,25.4 52.07,25.4 54.61,27.94 54.61,34.29 50.16,38.73 48.26,38.73 47.94,38.42 46.35,38.42 46.04,38.1 46.04,36.83 46.32,36.55 IC1.8
N$41
  Top 0.254: IC1.4 46.53,33.95 46.21,34.27 46.21,34.43 45.09,35.56 45.09,38.73 45.72,39.37 46.99,39.37 48.26,40.64 JP2.1
N$42
  Top 0.254: IC4.7 IC4.8 47.32,28.05 R19.1
N$43
  Top 0.254: IC4.3 41.31,27.05 R17.1 39.16,29.21 34.92,29.21 34.29,29.84 34.29,41.91 37.47,45.09 41.91,45.09 43.18,46.35 JP4.3
N$44
  Top 0.254: IC4.4 39.27,26.55 R18.1 34.51,28.36 33.66,29.21 33.66,42.55 36.83,45.72 39.37,45.72 40.64,46.99 JP4.2
N$45
  Top 0.254: IC3.4 99.99,28.23 100.97,29.21 100.97,35.56 JP3.1
N$46
  Top 0.254: IC1.14 39.31,35.9 39.14,36.07 38.85,36.07 36.2,38.73 36.2,42.55 36.83,43.18 39.37,43.18 40.64,41.91 JP2.4
N$47
  Top 0.254: IC1.13 39.02,36.55 38.1,37.46 JP2.5
N$49
  Top 0.254: IC3.14 88.69,30.19 87,31.88 87,38.1 87.63,38.73 91.44,38.73 92.08,38.1 JP3.4
N$50
  Top 0.254: IC3.13 88.86,30.84 87.95,31.75 87.95,33.02 89.53,34.61 JP3.5
N$51
  Top 0.254: IC1.20 37.63,32 R20.1
N$52
  Top 0.254: IC3.20 87.67,26.28 R21.1
N$53
  Top 0.254: R20.2 35.4,35.94 LED1.1
N$54
  Top 0.254: R21.2 85.56,30.1 LED2.1
N$55
  Top 0.254: U1.3 42.01,10.16 40.85,11.31 R22.2
N$56
  Top 0.254: U2.3 92.08,10.16 91.02,11.22 R23.2
N$57
  Top 0.254: R24.2 LED3.1
N$58
  Top 0.254: LED4.1 R25.2
N$59
  Top 0.254: IC2.34 80.92,60.59 C8.2
N$61
  Top 0.254: C10.2 74.08,71.12 Y1.1 76.52,68.26 79.06,65.72 79.06,63.5 81.42,61.14 IC2.33
N$62
  Top 0.254: C9.1 79.58,71.12 Y1.2 79.58,63.93 81.92,61.6 IC2.32
N$63
  Top 0.254: IC2.24 89.35,57.01 90.49,55.88 97.47,55.88 99.06,57.47 103.19,57.47 IC5.6 R33.1
N$64
  Top 0.254: IC2.22 86.22,56.01 87,55.24 99.47,55.24 IC5.5 R34.1
N$65
  Top 0.254: IC2.35 80.42,60.24 78.42,62.23 R31.1
N$66
  Top 0.254: IC2.25 89.49,57.51 90.49,56.51 93.66,56.51 95.99,58.84 R32.1
N$67
  Top 0.254: LED5.2 R35.2
N$68
  Top 0.254: IC2.28 85.41,60.81 85.41,63.18 LED5.1 86.46,63.23 R36.2
N$69
  Top 0.254: IC2.26 89.55,58.01 R37.1 C12.2
N$71
  Top 0.813: J11.1 14.3,60.92 16.88,63.5 IC7.4 IC7.3
  pour Top (no thermals): 1.27,53.34 12.7,53.34 18.41,59.05 18.41,64.77 1.27,64.77
N$72
  Top 0.813: J10.2 13.93,69.89 16.51,67.31 IC7.1 IC7.2
  pour Top (no thermals): 1.27,77.47 12.7,77.47 18.41,71.75 18.41,66.04 1.27,66.04
PWR3  (via drill 0.25)
  Top 0.254: 80.64,11.41 J3.A4 79.7,11.43 | 80.64,11.41 J3.B9 81.57,11.43 v82.55,11.43 82.55,17.99 R5.2 | 80.64,8.91 J3.A9 78.76,8.91 | 80.64,8.91 J3.B4 | 80.64,11.41 v80.64,12.06 | 78.76,8.91 v78.74,8.89 | 80.64,8.91 v80.64,8.25 | U2.4 91.28,9.66 | 91.28,9.16 v91.28,9.52 91.28,9.66 | U2.5 91.28,9.16 | 91.28,9.16 v91.28,8.89 | 91.28,9.66 v91.28,10.16 | R6.2 78.76,2.32 78.76,8.91
  pour +5v_Plane: 78.11,13.97 92.08,13.97 92.08,6.35 78.11,6.35
PWR4  (via drill 0.25)
  Top 0.254: J4.A4 107.31,11.41 | 107.31,11.41 J4.B9 109.22,11.41 v109.22,11.43 109.22,17.99 R7.2 | 107.31,8.91 J4.A9 106.39,8.89 v105.41,8.89 105.41,2.54 109.64,2.54 R8.2 | 107.31,8.91 J4.B4 | U2.11 96.52,9.16 | U2.12 96.52,9.66 | 96.52,9.66 v96.52,9.52 96.52,9.16 | 96.52,9.66 v96.52,10.16 | 96.52,9.16 v96.52,8.89 | 107.31,11.41 v107.31,12.06 | 107.31,8.91 v107.31,8.25
  pour +5v_Plane: 95.89,13.97 95.89,6.35 109.86,6.35 109.86,13.97
UP_N
  Top 0.203: IC2.30 82.92,60.27 82.83,60.36 82.83,65.38 84.15,66.7 86.34,66.7 87.61,67.97 112.7,67.97 120.32,60.35 120.32,18.18 128.49,10.01 130.43,10.01 130.53,9.91 J5.A7 131.67,9.91 131.76,10 131.88,10 131.88,10.01 132.06,10.01 132.32,10.27 132.34,10.27 132.49,10.41 J5.B7
UP_P  (via drill 0.25)
  Top 0.203: IC2.31 82.42,60.27 82.5,60.36 82.5,65.52 84.01,67.03 86.21,67.03 87.47,68.3 112.84,68.3 120.65,60.49 120.65,18.31 128.63,10.34 131.08,10.34 J5.A6
  Top 0.254: J5.A6 131.69,10.41 v132.08,10.79 | J5.B6 132.47,9.91 v132.08,9.52
  +3v3_Plane 0.254: v132.08,10.79 v132.08,9.52

### Text on the board
tNames: Mains | FAN | +5v / +3v3 / 0v | Mains | 0-D-C | SBC² | 0v | 5 Slot SBC Cluster Board / (c) Birty - Rev 0.3 | +5v | +5v +3v3